# Altium project LimeSDR_1v2.PrjPcb (part 1 of 2)
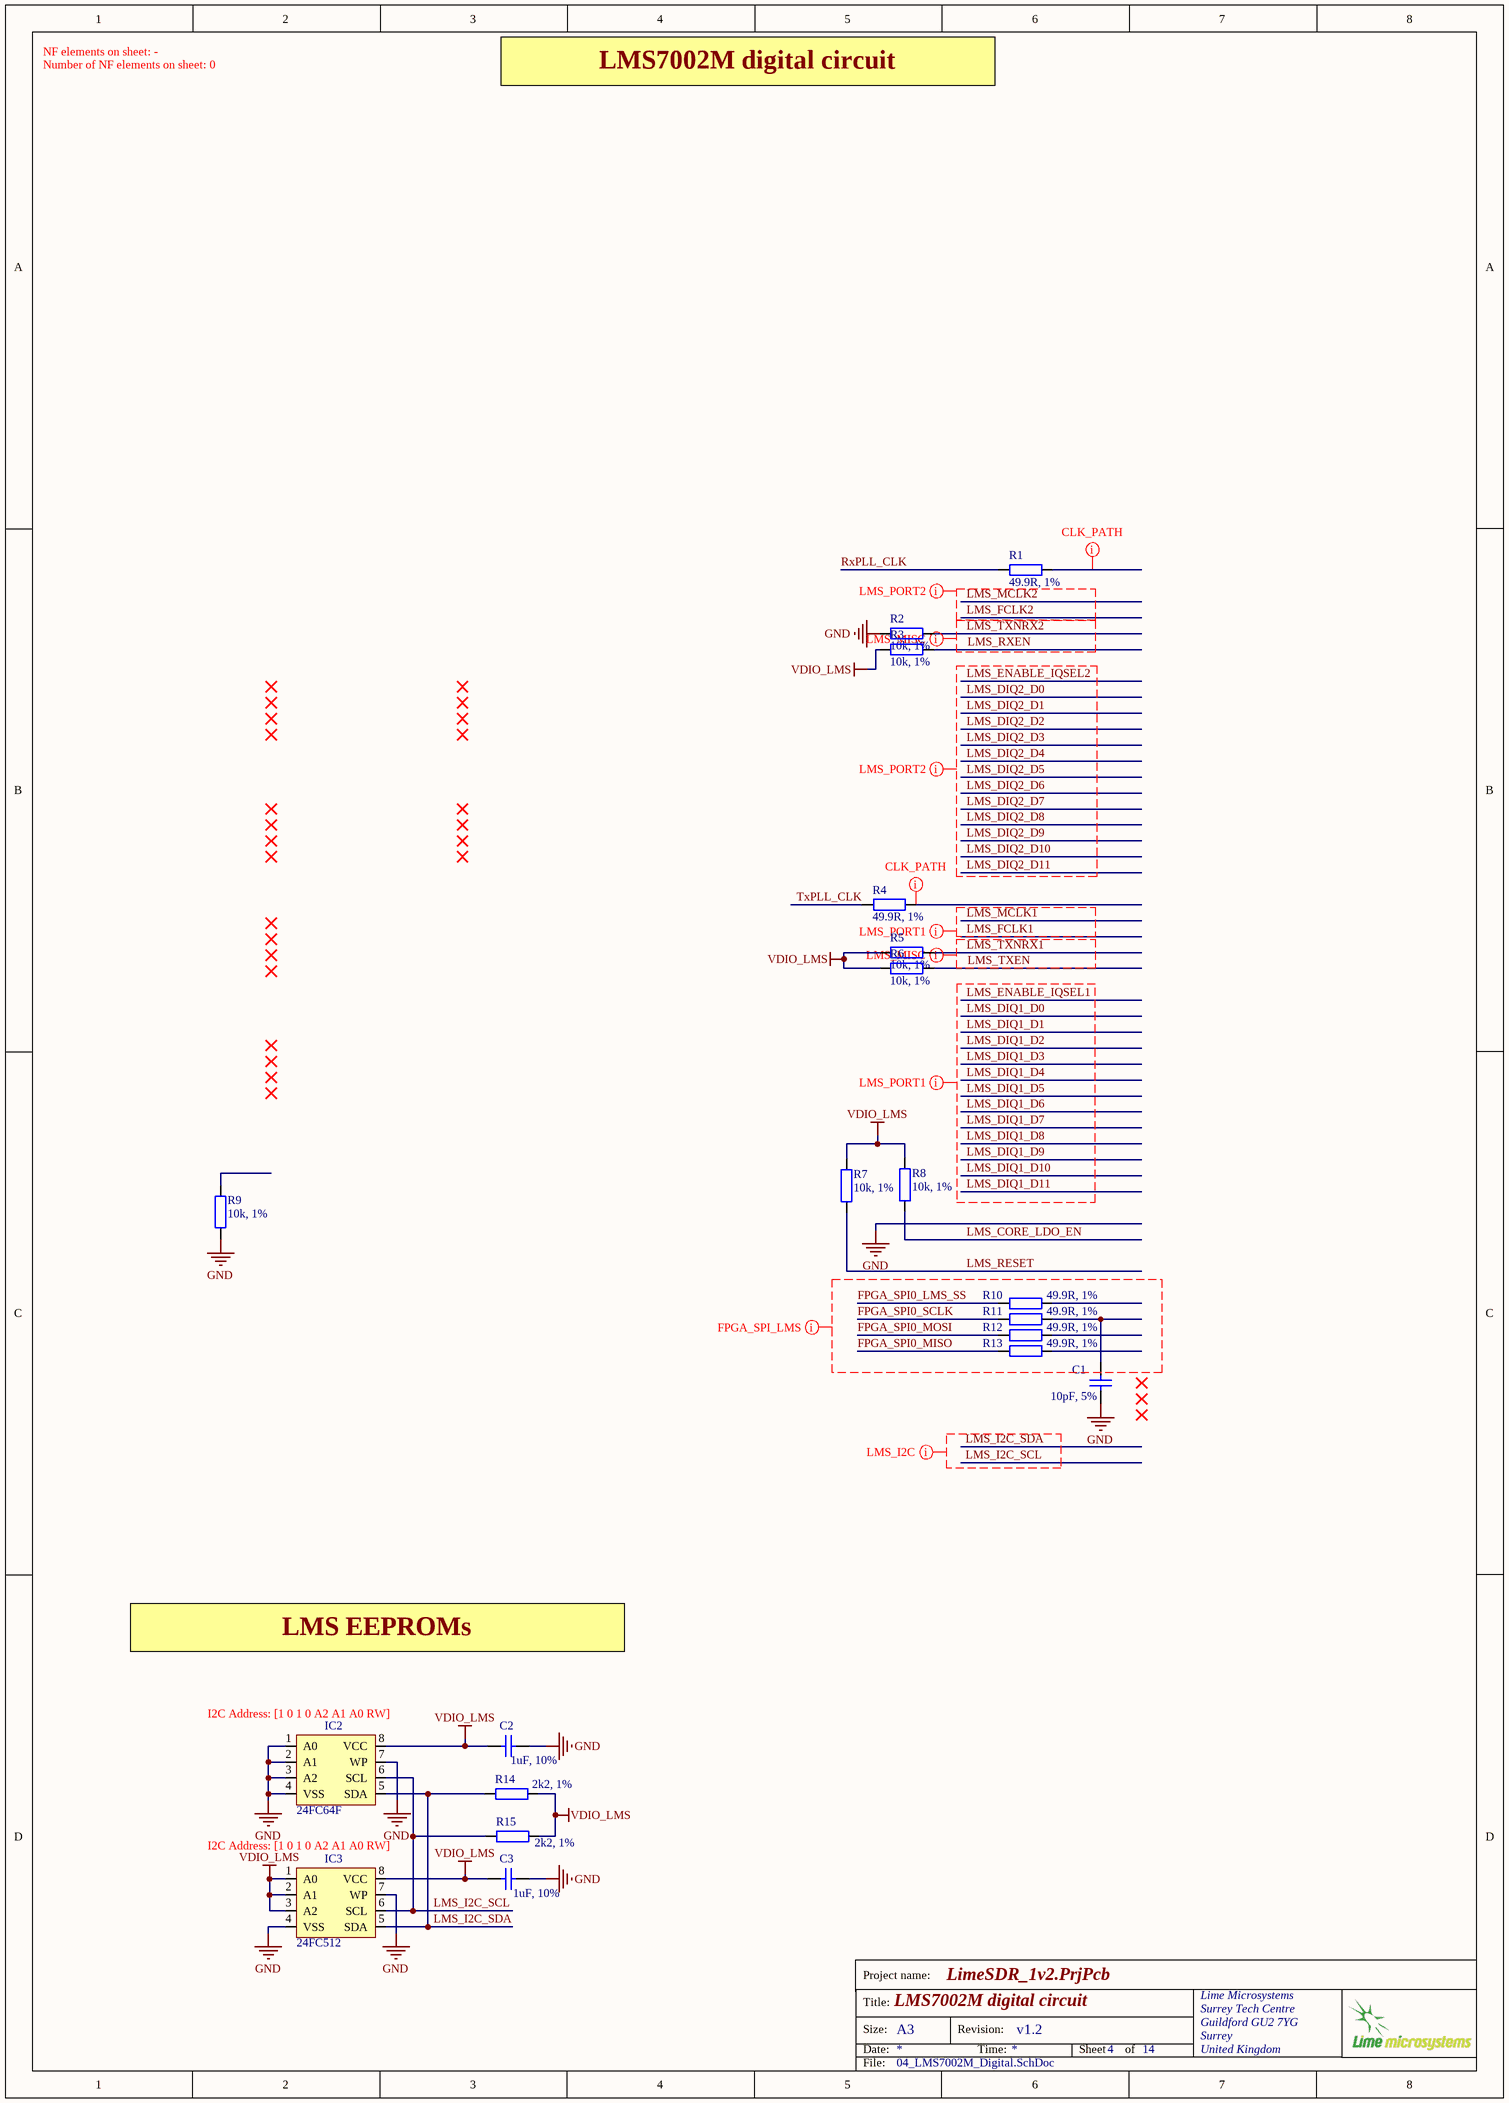
[diagram p0: 04_LMS7002M_Digital.SchDoc]
8 sheets, 375 parts. Net scope: global (net labels, ports and power ports of the same name join across sheets).
Board file: LimeSDR_1v2.PcbDoc
Sheets:
  04_LMS7002M_Digital.SchDoc
  05_LMS7002M_RF.SchDoc
  06_LMS7002M_Power.SchDoc
  07_FPGA_banks_1_2_3_4.SchDoc
  08_FPGA_banks_5_6_7_8.SchDoc
  10_DDR2.SchDoc
  12_USB3_0_power.SchDoc
  13_Clocks.SchDoc

## Sheet 04_LMS7002M_Digital.SchDoc: LMS7002M digital circuit
size A3 portrait; Organization: Lime Microsystems; Address1: Surrey Tech Centre; Address2: Guildford GU2 7YG; Address3: Surrey; Address4: United Kingdom; Revision: v1.2; SheetNumber: 4; SheetTotal: 14

### Parts
C1  10pF, 5%  [CAP0402]
C2  1uF, 10%  [CAP0402]
C3  1uF, 10%  [CAP0402]
IC2  24FC64F  [24FC512]
IC3  24FC512  [24FC512]
R1  49.9R, 1%  [RES0402]
R2  10k, 1%  [RES0402]
R3  10k, 1%  [RES0402]
R4  49.9R, 1%  [RES0402]
R5  10k, 1%  [RES0402]
R6  10k, 1%  [RES0402]
R7  10k, 1%  [RES0402]
R8  10k, 1%  [RES0402]
R9  10k, 1%  [RES0402]
R10  49.9R, 1%  [RES0402]
R11  49.9R, 1%  [RES0402]
R12  49.9R, 1%  [RES0402]
R13  49.9R, 1%  [RES0402]
R14  2k2, 1%  [RES0402]
R15  2k2, 1%  [RES0402]

### Nets
GND: C1.2 C2.1 C3.1 IC2.1(A0) IC2.2(A1) IC2.3(A2) IC2.4(VSS) IC2.7(WP) IC3.4(VSS) IC3.7(WP) R2.1 R9.2
VDIO_LMS: C2.2 C3.2 IC2.8(VCC) IC3.1(A0) IC3.2(A1) IC3.3(A2) IC3.8(VCC) R3.1 R5.1 R6.1 R7.2 R8.2 R14.1 R15.1
FPGA_SPI0_LMS_SS: R10.2
FPGA_SPI0_MISO: R13.2
FPGA_SPI0_MOSI: R12.2
FPGA_SPI0_SCLK: R11.2
LMS_CORE_LDO_EN: R8.1
LMS_I2C_SCL: IC2.6(SCL) IC3.6(SCL) R15.2
LMS_I2C_SDA: IC2.5(SDA) IC3.5(SDA) R14.2
LMS_RESET: R7.1
LMS_RXEN: R3.2
LMS_TXEN: R6.2
LMS_TXNRX1: R5.2
LMS_TXNRX2: R2.2
RxPLL_CLK: R1.2
TxPLL_CLK: R4.2
NetC1_1: C1.1 R11.1

Not connected (* = marked no-connect by the designer): R1 1; R4 1; R9 1; R10 1; R12 1; R13 1

### Layout directives
net class CLK_PATH: NetR1_1, NetR4_1
net class FPGA_SPI_LMS: FPGA_SPI0_LMS_SS, FPGA_SPI0_MISO, FPGA_SPI0_MOSI, FPGA_SPI0_SCLK
net class LMS_I2C: LMS_I2C_SCL, LMS_I2C_SDA
net class LMS_MISC: LMS_RXEN, LMS_TXNRX1, LMS_TXNRX2
net class LMS_PORT2: LMS_DIQ2_D0, LMS_DIQ2_D1, LMS_DIQ2_D2, LMS_DIQ2_D3, LMS_DIQ2_D4, LMS_DIQ2_D5, LMS_DIQ2_D6, LMS_DIQ2_D7, LMS_DIQ2_D8, LMS_DIQ2_D9, LMS_DIQ2_D10, LMS_DIQ2_D11, LMS_ENABLE_IQSEL2, LMS_FCLK2, LMS_MCLK2
net class LMS_PORT1: LMS_DIQ1_D0, LMS_DIQ1_D1, LMS_DIQ1_D2, LMS_DIQ1_D3, LMS_DIQ1_D4, LMS_DIQ1_D5, LMS_DIQ1_D6, LMS_DIQ1_D7, LMS_DIQ1_D8, LMS_DIQ1_D9, LMS_DIQ1_D10, LMS_DIQ1_D11, LMS_ENABLE_IQSEL1, LMS_MCLK1

### Notes on the sheet
- NF elements on sheet: -
- Number of NF elements on sheet: 0
- LMS7002M digital circuit
- LMS EEPROMs
- (near IC2) I2C Address: [1 0 1 0 A2 A1 A0 RW]
- (near IC3) I2C Address: [1 0 1 0 A2 A1 A0 RW]
- Project name:
- Title:
- Size:
- Date:
- A3
- Revision:
- Time:
- Sheet
- of
- File:

### Library data of the parts
C1 = Cap_0402: Manufacturer Part Number 1: 04023A100JAT2A; Manufacturer: AVX; Part Description: 10pF ±5% 25V C0G, NP0, Ceramic Capacitor, Surface Mount, MLCC 0402; Voltage Rating: 25; Ceramic Capacitor Case: 0402 [1005 Metric]; Capacitor Case Style: 0402 [1005 Metric]<!--FANDB--><div class="features-and-benefits-container"></div>; Dielectric Characteristic: C0G / NP0; SVHC: No SVHC (16-Jun-2014); Capacitance: 10; Value: 10pF, 5%; Supplier 1: Farnell; Supplier Part Number 1: 2332478RL; Capacitance Tolerance: ± 5%; Product Range: -; RoHS: YES; Operating Temperature Min: -55; Operating Temperature Max: 125; Capacitance Tolerance ±: ± 5%; MSL: MSL 1 - Unlimited; Packaging: Cut Tape
C2 C3 = Cap_0402: Manufacturer Part Number 1: GRM155R61A105KE15J; Manufacturer: TDK; Part Description: 1µF ±10% 10V X5R Ceramic Capacitor -55°C ~ 85°C Surface Mount, MLCC 0402 (1005 Metric) 0.039" L x 0.020" W (1.00mm x 0.50mm); Voltage Rating: 10; Product Range: TDK - C Series; Ceramic Capacitor Case: 0402 [1005 Metric]; Capacitance: 1; Dielectric Characteristic: X6; Value: 1uF, 10%; Supplier 1: Newark; Supplier Part Number 1: 490-6298-2-ND; Capacitance Tolerance: ± 10%; MSL: -; RoHS: YES
IC2 = 24FC64F: Manufacturer Part Number 1: 24FC64F-I/ST; Manufacturer: Microchip Technology; Part Description: IC EEPROM 64KBIT 1MHZ 8TSSOP; Format - Memory: EEPROMs - Serial; Speed: 400kHz, 1MHz; Interface: I²C, 2-Wire Serial; Memory Type: EEPROM; Memory Size: 64K (8K x 8); Voltage - Supply: 1.7 V ~ 5.5 V; Supplier 1: Digi-Key; Packaging: Tube; Supplier Device Package: 8-TSSOP; Operating Temperature: -40°C ~ 85°C; RoHS: RoHS Compliant; Category: Integrated Circuits (ICs); Package / Case: 8-TSSOP (0.173", 4.40mm Width); Supplier Part Number 1: 24FC64F-I/ST-ND
IC3 = 24FC512: Manufacturer Part Number 1: 24FC512-I/ST; Manufacturer: Microchip Technology; Part Description: IC EEPROM 512KBIT 1MHZ 8TSSOP; Speed: 400kHz, 1MHz; Memory Type: EEPROM; Memory Size: 512K (64K x 8); Voltage - Supply: 1.7 V ~ 5.5 V; Interface: I²C, 2-Wire Serial; Format - Memory: EEPROMs - Serial; Supplier 1: Digi-Key; RoHS: RoHS Compliant; Packaging: Tube; Operating Temperature: -40°C ~ 85°C; Supplier Device Package: 8-TSSOP; Category: Integrated Circuits (ICs); Package / Case: 8-TSSOP (0.173", 4.40mm Width); Supplier Part Number 1: 24FC512-I/ST-ND
R1 R4 R10-R13 = Res_0402: Manufacturer: Samsung Electro-Mechanics America, Inc.; Manufacturer Part Number: RC1005F49R9CS; Part Description: RES SMD 49.9 OHM 1% 1/16W 0402; Temperature Coefficient: ±100ppm/°C; Resistance (Ohms): 49.9; Power (Watts): 0.063W, 1/16W; Number of Terminations: 2; Size / Dimension: 0.039" L x 0.020" W (1.00mm x 0.50mm); Supplier Device Package: 0402 (1005 Metric); RoHS: RoHS Compliant; Supplier Part Number 1: 1276-3469-6-ND; Features: -; Packaging: Digi-Reel®; Tolerance: ±1%; Height: 0.016" (0.40mm); Category: Resistors; Composition: Thick Film; Package / Case: 0402 (1005 Metric); Supplier 1: Digi-Key; Operating Temperature: -55°C ~ 155°C; Value: 49.9R, 1%
R2 R3 R5-R9 = Res_0402: Manufacturer: Yageo; Manufacturer Part Number 1: RC0402FR-0710KL; Part Description: RES SMD 10K OHM 1% 1/16W 0402; Temperature Coefficient: ±100ppm/°C; Power (Watts): 0.063W, 1/16W; Value: 10k, 1%; Supplier 1: Digi-Key; Supplier Part Number 1: 311-10.0KLRTR-ND; Resistance (Ohms): 10k; Packaging: Tape & Reel (TR); RoHS: RoHS Compliant; Package / Case: 0402 (1005 Metric); Tolerance: ±1%; Operating Temperature: -55°C ~ 155°C; Size / Dimension: 0.039" L x 0.020" W (1.00mm x 0.50mm); Number of Terminations: 2; Category: Resistors; Height: 0.016" (0.40mm); Supplier Device Package: 0402; Features: Moisture Resistant; Composition: Thick Film
R14 R15 = Res_0402: Manufacturer: Stackpole Electronics Inc; Manufacturer Part Number 1: RMCF0402FT2K20; Part Description: RES SMD 2.2K OHM 1% 1/16W 0402; Resistance (Ohms): 2.2k; Temperature Coefficient: ±100ppm/°C; Power (Watts): 0.063W, 1/16W; Value: 2k2, 1%; Supplier 1: Digi-Key; Supplier Part Number 1: RMCF0402FT2K20CT-ND; Supplier Device Package: 0402; Package / Case: 0402 (1005 Metric); Size / Dimension: 0.039" L x 0.020" W (1.00mm x 0.50mm); Operating Temperature: -55°C ~ 155°C; Composition: Thick Film; Category: Resistors; Features: -; Height: 0.016" (0.40mm); RoHS: RoHS Compliant; Number of Terminations: 2; Packaging: Cut Tape (CT); Tolerance: ±1%

## Sheet 05_LMS7002M_RF.SchDoc: LMS7002M RF
size A3; Organization: Lime Microsystems; Address1: Surrey Tech Centre; Address2: Guildford GU2 7YG; Address3: Surrey; Address4: United Kingdom; Revision: v1.2; SheetNumber: 5; SheetTotal: 14
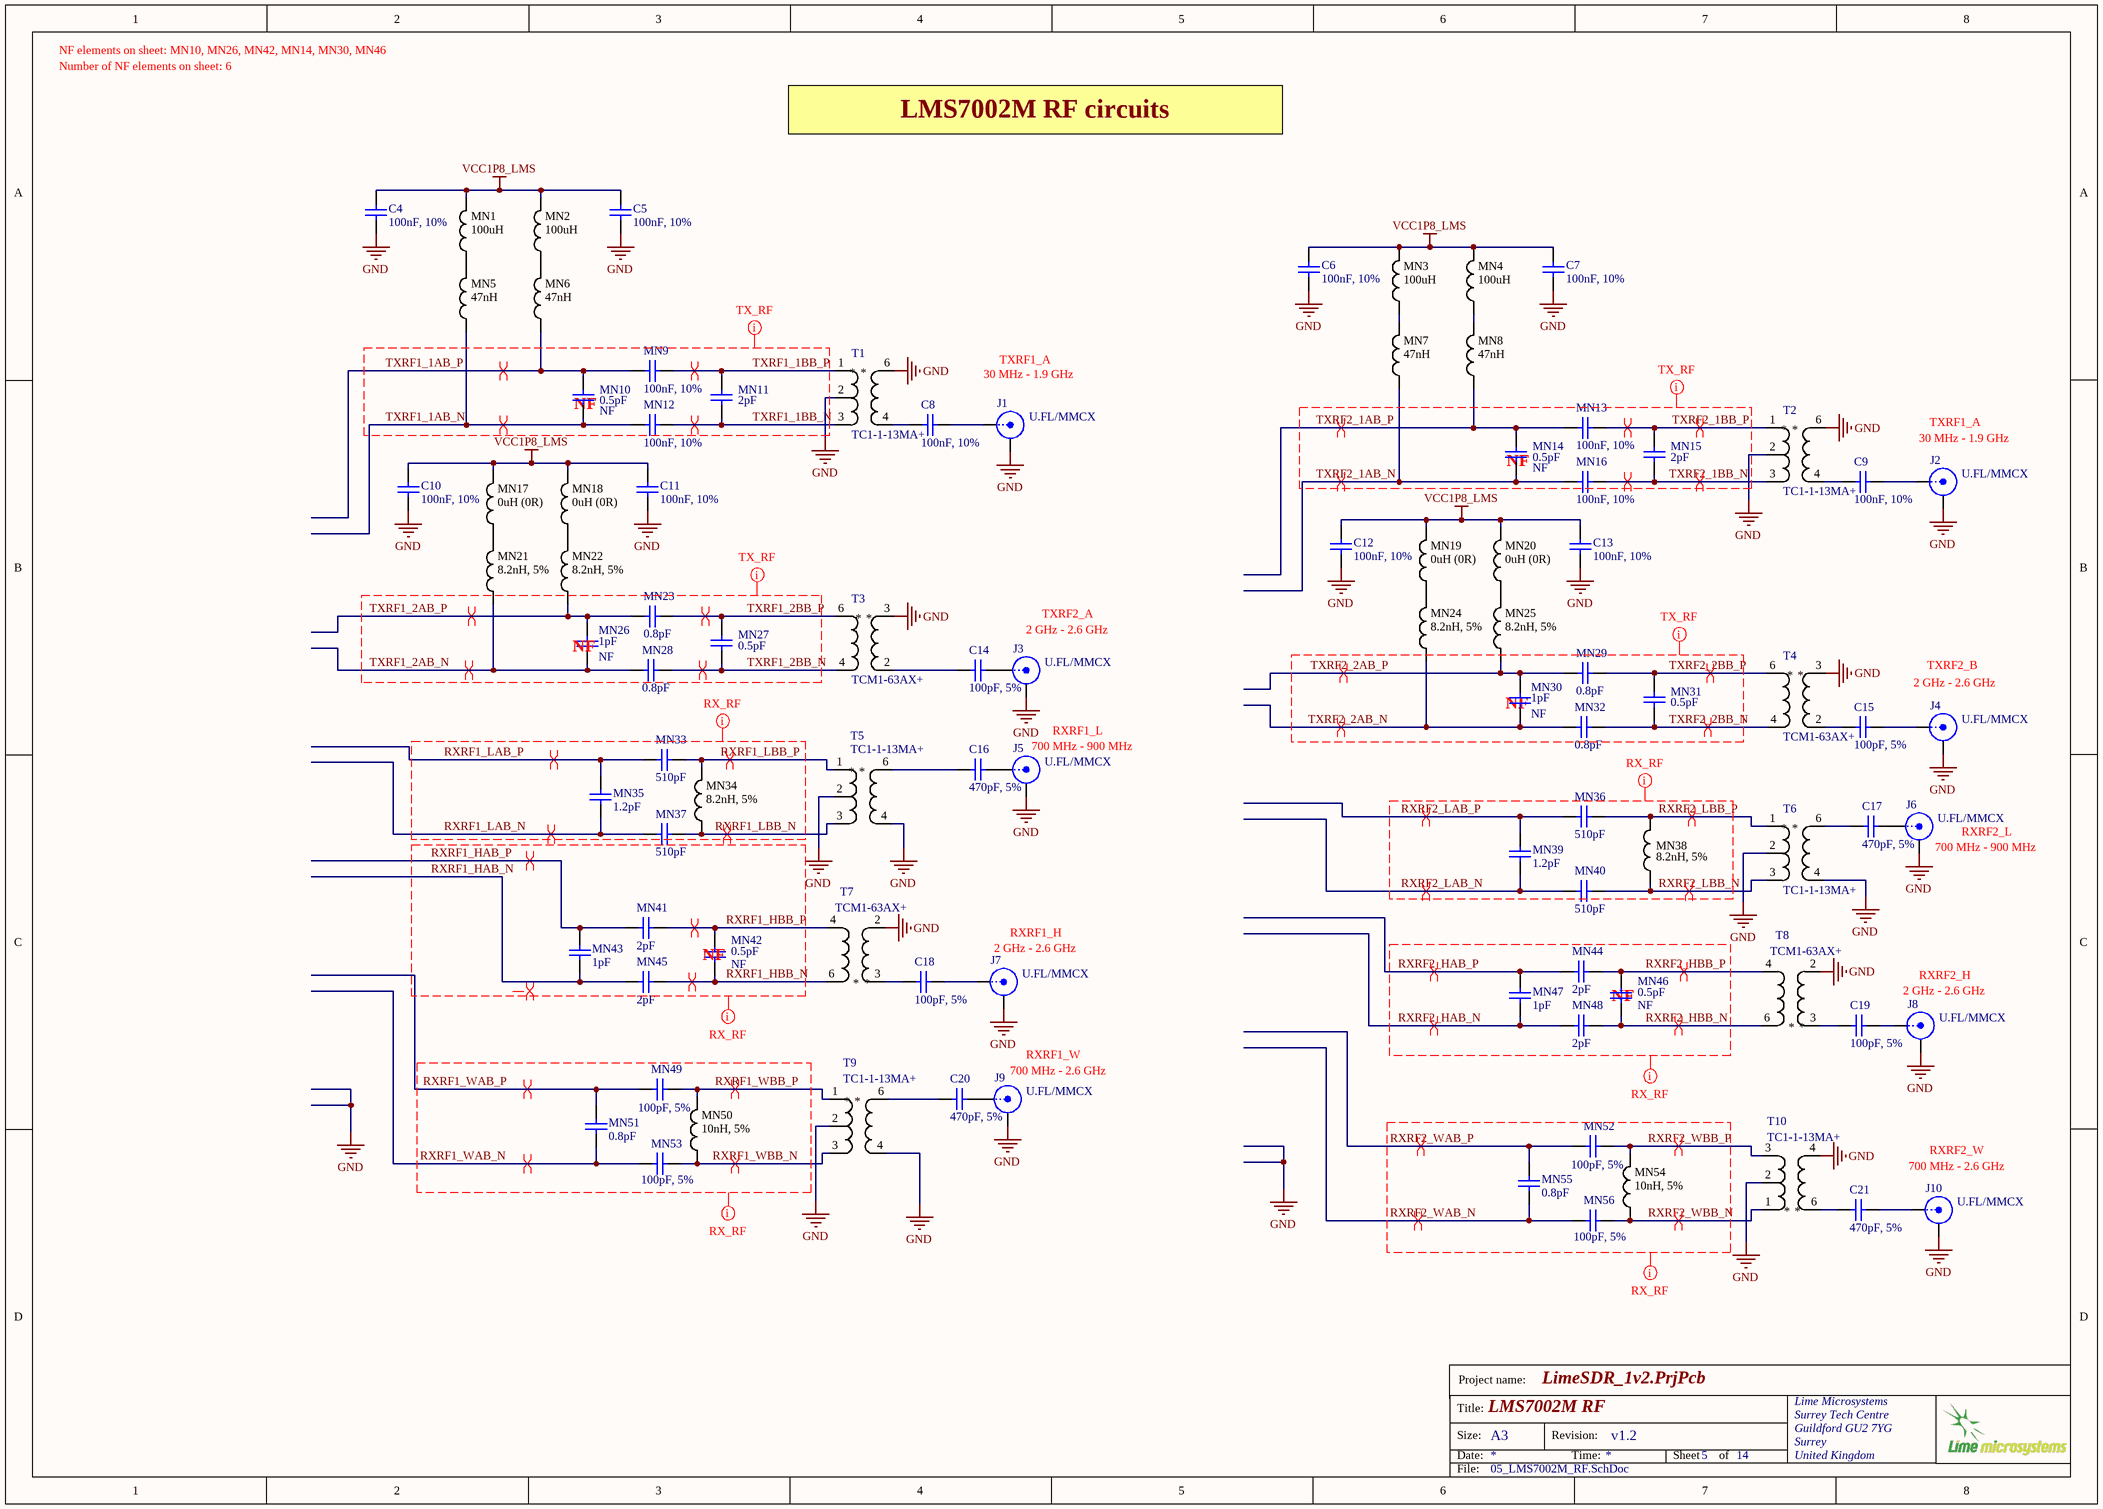
[diagram p1: 05_LMS7002M_RF.SchDoc]

### Parts
C4  100nF, 10%  [CAP0402]
C5  100nF, 10%  [CAP0402]
C6  100nF, 10%  [CAP0402]
C7  100nF, 10%  [CAP0402]
C8  100nF, 10%  [CAP0402]
C9  100nF, 10%  [CAP0402]
C10  100nF, 10%  [CAP0402]
C11  100nF, 10%  [CAP0402]
C12  100nF, 10%  [CAP0402]
C13  100nF, 10%  [CAP0402]
C14  100pF, 5%  [CAP0402]
C15  100pF, 5%  [CAP0402]
C16  470pF, 5%  [CAP0402]
C17  470pF, 5%  [CAP0402]
C18  100pF, 5%  [CAP0402]
C19  100pF, 5%  [CAP0402]
C20  470pF, 5%  [CAP0402]
C21  470pF, 5%  [CAP0402]
J1  U.FL/MMCX  [MMCX_UFL_conn_u]
J2  U.FL/MMCX  [MMCX_UFL_conn_u]
J3  U.FL/MMCX  [MMCX_UFL_conn_u]
J4  U.FL/MMCX  [MMCX_UFL_conn_u]
J5  U.FL/MMCX  [MMCX_UFL_conn_u]
J6  U.FL/MMCX  [MMCX_UFL_conn_u]
J7  U.FL/MMCX  [MMCX_UFL_conn_u]
J8  U.FL/MMCX  [MMCX_UFL_conn_u]
J9  U.FL/MMCX  [MMCX_UFL_conn_u]
J10  U.FL/MMCX  [MMCX_UFL_conn_u]
MN1  100uH  [RES0805]
MN2  100uH  [RES0805]
MN3  100uH  [RES0805]
MN4  100uH  [RES0805]
MN5  47nH  [RES0402]
MN6  47nH  [RES0402]
MN7  47nH  [RES0402]
MN8  47nH  [RES0402]
MN9  100nF, 10%  [CAP0402]
MN10  0.5pF  Assembly Info: NF  [CAP0402]
MN11  2pF  [CAP0402]
MN12  100nF, 10%  [CAP0402]
MN13  100nF, 10%  [CAP0402]
MN14  0.5pF  Assembly Info: NF  [CAP0402]
MN15  2pF  [CAP0402]
MN16  100nF, 10%  [CAP0402]
MN17  0uH (0R)  [RES0805]
MN18  0uH (0R)  [RES0805]
MN19  0uH (0R)  [RES0805]
MN20  0uH (0R)  [RES0805]
MN21  8.2nH, 5%  [RES0402]
MN22  8.2nH, 5%  [RES0402]
MN23  0.8pF  [CAP0402]
MN24  8.2nH, 5%  [RES0402]
MN25  8.2nH, 5%  [RES0402]
MN26  1pF  Assembly Info: NF  [CAP0402]
MN27  0.5pF  [CAP0402]
MN28  0.8pF  [CAP0402]
MN29  0.8pF  [CAP0402]
MN30  1pF  Assembly Info: NF  [CAP0402]
MN31  0.5pF  [CAP0402]
MN32  0.8pF  [CAP0402]
MN33  510pF  [CAP0402]
MN34  8.2nH, 5%  [RES0402]
MN35  1.2pF  [CAP0402]
MN36  510pF  [CAP0402]
MN37  510pF  [CAP0402]
MN38  8.2nH, 5%  [RES0402]
MN39  1.2pF  [CAP0402]
MN40  510pF  [CAP0402]
MN41  2pF  [CAP0402]
MN42  0.5pF  Assembly Info: NF  [CAP0402]
MN43  1pF  [CAP0402]
MN44  2pF  [CAP0402]
MN45  2pF  [CAP0402]
MN46  0.5pF  Assembly Info: NF  [CAP0402]
MN47  1pF  [CAP0402]
MN48  2pF  [CAP0402]
MN49  100pF, 5%  [CAP0402]
MN50  10nH, 5%  [RES0402]
MN51  0.8pF  [CAP0402]
MN52  100pF, 5%  [CAP0402]
MN53  100pF, 5%  [CAP0402]
MN54  10nH, 5%  [RES0402]
MN55  0.8pF  [CAP0402]
MN56  100pF, 5%  [CAP0402]
T1  TC1-1-13MA+  [TC1-1-13MA+_v2]
T2  TC1-1-13MA+  [TC1-1-13MA+_v2]
T3  TCM1-63AX+  [TCM1-63AX+_v2]
T4  TCM1-63AX+  [TCM1-63AX+_v2]
T5  TC1-1-13MA+  [TC1-1-13MA+_v2]
T6  TC1-1-13MA+  [TC1-1-13MA+_v2]
T7  TCM1-63AX+  [TCM1-63AX+_v2]
T8  TCM1-63AX+  [TCM1-63AX+_v2]
T9  TC1-1-13MA+  [TC1-1-13MA+_v2]
T10  TC1-1-13MA+  [TC1-1-13MA+_v2]

### Nets
GND: C4.1 C5.1 C6.1 C7.1 C10.1 C11.1 C12.1 C13.1 J1.2(Y) J2.2(Y) J3.2(Y) J4.2(Y) J5.2(Y) J6.2(Y) J7.2(Y) J8.2(Y) J9.2(Y) J10.2(Y) T1.2 T1.6 T2.2 T2.6 T3.3 T4.3 T5.2 T5.4 T6.2 T6.4 T7.2 T8.2 T9.2 T9.4 T10.2 T10.4
VCC1P8_LMS: C4.2 C5.2 C6.2 C7.2 C10.2 C11.2 C12.2 C13.2 MN1.2 MN2.2 MN3.2 MN4.2 MN17.2 MN18.2 MN19.2 MN20.2
RXRF1_HAB_N: MN43.1 MN45.2
RXRF1_HAB_P: MN41.2 MN43.2
RXRF1_HBB_N: MN42.1 MN45.1 T7.6
RXRF1_HBB_P: MN41.1 MN42.2 T7.4
RXRF1_LAB_N: MN35.1 MN37.2
RXRF1_LAB_P: MN33.2 MN35.2
RXRF1_LBB_N: MN34.1 MN37.1 T5.3
RXRF1_LBB_P: MN33.1 MN34.2 T5.1
RXRF1_WAB_N: MN51.2 MN53.2
RXRF1_WAB_P: MN49.2 MN51.1
RXRF1_WBB_N: MN50.1 MN53.1 T9.3
RXRF1_WBB_P: MN49.1 MN50.2 T9.1
RXRF2_HAB_N: MN47.1 MN48.2
RXRF2_HAB_P: MN44.2 MN47.2
RXRF2_HBB_N: MN46.1 MN48.1 T8.6
RXRF2_HBB_P: MN44.1 MN46.2 T8.4
RXRF2_LAB_N: MN39.1 MN40.2
RXRF2_LAB_P: MN36.2 MN39.2
RXRF2_LBB_N: MN38.1 MN40.1 T6.3
RXRF2_LBB_P: MN36.1 MN38.2 T6.1
RXRF2_WAB_N: MN55.2 MN56.2
RXRF2_WAB_P: MN52.2 MN55.1
RXRF2_WBB_N: MN54.1 MN56.1 T10.1
RXRF2_WBB_P: MN52.1 MN54.2 T10.3
TXRF1_1AB_N: MN5.1 MN10.1 MN12.1
TXRF1_1AB_P: MN6.1 MN9.2 MN10.2
TXRF1_1BB_N: MN11.1 MN12.2 T1.3
TXRF1_1BB_P: MN9.1 MN11.2 T1.1
TXRF1_2AB_N: MN21.1 MN26.2 MN28.2
TXRF1_2AB_P: MN22.1 MN23.2 MN26.1
TXRF1_2BB_N: MN27.1 MN28.1 T3.4
TXRF1_2BB_P: MN23.1 MN27.2 T3.6
TXRF2_1AB_N: MN7.1 MN14.1 MN16.1
TXRF2_1AB_P: MN8.1 MN13.2 MN14.2
TXRF2_1BB_N: MN15.1 MN16.2 T2.3
TXRF2_1BB_P: MN13.1 MN15.2 T2.1
TXRF2_2AB_N: MN24.1 MN30.2 MN32.2
TXRF2_2AB_P: MN25.1 MN29.2 MN30.1
TXRF2_2BB_N: MN31.1 MN32.1 T4.4
TXRF2_2BB_P: MN29.1 MN31.2 T4.6
NetC8_1: C8.1 J1.1(X)
NetC8_2: C8.2 T1.4
NetC9_1: C9.1 J2.1(X)
NetC9_2: C9.2 T2.4
NetC14_1: C14.1 J3.1(X)
NetC14_2: C14.2 T3.2
NetC15_1: C15.1 J4.1(X)
NetC15_2: C15.2 T4.2
NetC16_1: C16.1 J5.1(X)
NetC16_2: C16.2 T5.6
NetC17_1: C17.1 J6.1(X)
NetC17_2: C17.2 T6.6
NetC18_1: C18.1 J7.1(X)
NetC18_2: C18.2 T7.3
NetC19_1: C19.1 J8.1(X)
NetC19_2: C19.2 T8.3
NetC20_1: C20.1 J9.1(X)
NetC20_2: C20.2 T9.6
NetC21_1: C21.1 J10.1(X)
NetC21_2: C21.2 T10.6
NetMN1_1: MN1.1 MN5.2
NetMN2_1: MN2.1 MN6.2
NetMN3_1: MN3.1 MN7.2
NetMN4_1: MN4.1 MN8.2
NetMN17_1: MN17.1 MN21.2
NetMN18_1: MN18.1 MN22.2
NetMN19_1: MN19.1 MN24.2
NetMN20_1: MN20.1 MN25.2

### Layout directives
differential pair: RXRF1_HAB_N, RXRF1_HAB_P, RXRF1_HBB_N, RXRF1_HBB_P, RXRF1_LAB_N, RXRF1_LAB_P, RXRF1_LBB_N, RXRF1_LBB_P, RXRF1_WAB_N, RXRF1_WAB_P, RXRF1_WBB_N, RXRF1_WBB_P, RXRF2_HAB_N, RXRF2_HAB_P, RXRF2_HBB_N, RXRF2_HBB_P, RXRF2_LAB_N, RXRF2_LAB_P, RXRF2_LBB_N, RXRF2_LBB_P, RXRF2_WAB_N, RXRF2_WAB_P, RXRF2_WBB_N, RXRF2_WBB_P, TXRF1_1AB_N, TXRF1_1AB_P, TXRF1_1BB_N, TXRF1_1BB_P, TXRF1_2AB_N, TXRF1_2AB_P, TXRF1_2BB_N, TXRF1_2BB_P, TXRF2_1AB_N, TXRF2_1AB_P, TXRF2_1BB_N, TXRF2_1BB_P, TXRF2_2AB_N, TXRF2_2AB_P, TXRF2_2BB_N, TXRF2_2BB_P
net class TX_RF: TXRF1_1AB_N, TXRF1_1AB_P, TXRF1_1BB_N, TXRF1_1BB_P, TXRF1_2AB_N, TXRF1_2AB_P, TXRF1_2BB_N, TXRF1_2BB_P, TXRF2_1AB_N, TXRF2_1AB_P, TXRF2_1BB_N, TXRF2_1BB_P, TXRF2_2AB_N, TXRF2_2AB_P, TXRF2_2BB_N, TXRF2_2BB_P
net class RX_RF: RXRF1_HAB_N, RXRF1_HAB_P, RXRF1_HBB_N, RXRF1_HBB_P, RXRF1_LAB_N, RXRF1_LAB_P, RXRF1_LBB_N, RXRF1_LBB_P, RXRF1_WAB_N, RXRF1_WAB_P, RXRF1_WBB_N, RXRF1_WBB_P, RXRF2_HAB_N, RXRF2_HAB_P, RXRF2_HBB_N, RXRF2_HBB_P, RXRF2_LAB_N, RXRF2_LAB_P, RXRF2_LBB_N, RXRF2_LBB_P, RXRF2_WAB_N, RXRF2_WAB_P, RXRF2_WBB_N, RXRF2_WBB_P

### Notes on the sheet
- Number of NF elements on sheet: 6
- NF elements on sheet: MN10, MN26, MN42, MN14, MN30, MN46
- LMS7002M RF circuits
- 30 MHz - 1.9 GHz
- TXRF1_A
- (near MN10) NF
- (near J2) 30 MHz - 1.9 GHz
- (near MN14) NF
- (near MN26) NF
- 2 GHz - 2.6 GHz
- TXRF2_A
- (near MN30) NF
- TXRF2_B
- (near J5) 700 MHz - 900 MHz
- RXRF1_L
- (near J6) 700 MHz - 900 MHz
- (near J6) RXRF2_L
- (near MN42) NF
- (near J7) 2 GHz - 2.6 GHz
- (near J7) RXRF1_H
- RXRF2_H
- RXRF1_W
- (near MN46) NF
- (near J8) 2 GHz - 2.6 GHz
- (near J9) 700 MHz - 2.6 GHz
- 700 MHz - 2.6 GHz
- (near J10) RXRF2_W
- Project name:
- Title:
- Size:
- Date:
- A3
- Revision:
- Time:
- Sheet
- of
- File:

### Library data of the parts
C4-C13 = Cap_0402: Manufacturer: Murata Electronics; Manufacturer Part Number: GRM155R71C104KA88D; Part Description: 0.10µF ±10% 16V X7R Ceramic Capacitor -55°C ~ 125°C Surface Mount, MLCC 0402 (1005 Metric) 0.039" L x 0.020" W (1.00mm x 0.50mm); Voltage Rating DC: 16 V; Type: General Purpose MLCC; Capacitance: 0.1 uF; Case Length: 1 mm; Dielectric: X7R; Case Height: 0.5 mm; Temperature Coefficient / Code: +/- 15 %; Value: 100nF, 10%; Supplier 1: Mouser; Supplier Part Number 1: 81-GRM155R71C104KA88; Case Code - in: 0402; RoHS: RoHS Compliant; Operating Temperature Range: - 55 C to + 125 C; Series: GRM; Termination Style: SMD/SMT; Tolerance: 10 %; Package / Case: 0402 (1005 metric); Maximum Operating Temperature: + 125 C; Case Code - mm: 1005; Minimum Operating Temperature: - 55 C; Product Category: Low & Medium Capacitance SMD Ceramic Chip Capacitors; Packaging: Reel; Product: General Type MLCCs; Category: Multilayer Ceramic Capacitors MLCC - SMD/SMT; Brand: Murata Electronics; Case Width: 0.5 mm; RoHS - Mouser: Y; Standard Pack Qty: 10000; Minimum Order Quantity: 1; Reeling: True; Manufacturer Part Number 1: GRM155R71C104KA88D
C14 C15 C18 C19 MN49 MN52 MN53 MN56 = Cap_0402: Manufacturer Part Number 1: CC0402JRNPO9BN101; Manufacturer: Yageo; Part Description: 100pF ±5% 50V C0G, NP0 Ceramic Capacitor -55°C ~ 125°C Surface Mount, MLCC 0402 (1005 Metric) 0.039" L x 0.020" W (1.00mm x 0.50mm); Temperature Coefficient: C0G, NP0; Voltage - Rated: 50V; Value: 100pF, 5%; Capacitance: 100pF; Thickness (Max): 0.022" (0.55mm); Size / Dimension: 0.039" L x 0.020" W (1.00mm x 0.50mm); Tolerance: ±5%; RoHS: RoHS Compliant; Ratings: -; Package / Case: 0402 (1005 Metric); Mounting Type: Surface Mount, MLCC; Height - Seated (Max): -; Features: -; Lead Spacing: -; Operating Temperature: -55°C ~ 125°C; Packaging: Cut Tape (CT); Applications: General Purpose; Lead Style: -; Supplier 1: Digi-Key; Category: Capacitors; Supplier Part Number 1: 311-1024-1-ND
C16 C17 C20 C21 = Cap_0402: Manufacturer Part Number: C1005C0G1H471J050BA; Manufacturer: TDK Corporation; Part Description: 470pF ±5% 50V C0G, NP0 Ceramic Capacitor -55°C ~ 125°C Surface Mount, MLCC 0402 (1005 Metric) 0.039" L x 0.020" W (1.00mm x 0.50mm); Temperature Coefficient: C0G, NP0; Voltage - Rated: 50V; Value: 470pF, 5%; Supplier 1: Digi-Key; Supplier Part Number 1: 445-2656-6-ND; Ratings: -; Package / Case: 0402 (1005 Metric); Capacitance: 470pF; Packaging: Digi-Reel®; RoHS: RoHS Compliant; Tolerance: ±5%; Lead Style: -; Thickness (Max): 0.022" (0.55mm); Size / Dimension: 0.039" L x 0.020" W (1.00mm x 0.50mm); Lead Spacing: -; Operating Temperature: -55°C ~ 125°C; Height - Seated (Max): -; Applications: General Purpose; Mounting Type: Surface Mount, MLCC; Category: Capacitors; Features: -
J1-J10 = RF_IF_connector: CONN UMC RCPT STR 50 OHM SMD; Manufacturer: Molex, LLC; Manufacturer Part Number 1: 0734120110; Body Finish: Nickel; Body Material: Phosphor Bronze; Center Contact Material: Brass; Center Contact Plating: Gold; Connector Style: Ultra Miniature Coaxial; Connector Type: Jack, Male Pin; Contact Termination: Solder; Dielectric Material: Liquid Crystal Polymer (LCP); Frequency - Max: 6GHz; Impedance: 50 Ohm; Voltage Rating: 60V; Cable Group: -; Category: Connectors, Interconnects; Fastening Type: Snap-On; Features: -; Housing Color: Silver; Ingress Protection: -; Mounting Type: Surface Mount; Operating Temperature: -40°C ~ 90°C; Packaging: Cut Tape (CT); RoHS: RoHS Compliant; Shield Termination: Solder; Supplier 1: Digi-Key; Supplier Part Number 1: WM5587CT-ND; Part Description: CONN UMC RCPT STR 50 OHM SMD
MN1-MN4 = Inductor_0603: Manufacturer: TDK Corporation; Manufacturer Part Number: MLF2012C101KT000; Part Description: FIXED IND 100UH 2MA 3.1 OHM SMD; Q @ Freq: 25 @ 1MHz; Shielding: Shielded; Current Rating: 2mA; Frequency - Self Resonant: 7MHz; Frequency - Test: 1MHz; Material - Core: Ferrite; Tolerance: ±10%; Inductance: 100µH; DC Resistance (DCR): 3.1 Ohm Max; Value: 100uH; Supplier 1: Digi-Key; Supplier Part Number 1: 445-1071-1-ND; Supplier Device Package: 0805 (2012 Metric); Size / Dimension: 0.079" L x 0.049" W (2.00mm x 1.25mm); Operating Temperature: -40°C ~ 85°C; Packaging: Cut Tape (CT); RoHS: RoHS Compliant; Current - Saturation: -; Height - Seated (Max): 0.057" (1.45mm); Package / Case: 0805 (2012 Metric); Mounting Type: Surface Mount; Type: Multilayer; Category: Inductors, Coils, Chokes
MN5-MN8 = Inductor_0603: Manufacturer: COILCRAFT; Manufacturer Part Number: 0402HP-47NXJLU; Part Description: INDUCTOR, RF, 47NH, 5%, 2.4GHZ, SMD; Product Range:0402HP Series; Inductance:47nH; Inductance Tolerance:± 5%; High Frequency Inductor Case:0402 [1005 Metric]; Self Resonant Frequency Min:2.4GHz; DC Resistance Max:0.58ohm; DC Current Rating:420mA; SVHC: No SVHC (15-Jun-2015); Inductance Tolerance: ± 5%; High Frequency Inductor Case: 0402 [1005 Metric]; Inductor Case Style: 0402 [1005 Metric]<!--FANDB--><div class="features-and-benefits-container"></div>; Inductance: 47; DC Resistance Max: 0.58; Self Resonant Frequency Min: 2.4; Product Range: 0402; DC Current Rating: 420; Inductor Construction: Wirewound; Supplier 1: Farnell; Supplier Part Number 1: 2285856; Packaging: Cut Tape; RoHS: Y-EX; value: 47nH
MN9 MN12 MN13 MN16 = Cap_0402: Manufacturer: Murata Electronics; Manufacturer Part Number: GRM155R71C104KA88D; Part Description: 0.10µF ±10% 16V X7R Ceramic Capacitor -55°C ~ 125°C Surface Mount, MLCC 0402 (1005 Metric) 0.039" L x 0.020" W (1.00mm x 0.50mm); Voltage Rating DC: 16 V; Capacitance: 0.1 uF; Case Length: 1 mm; Dielectric: X7R; Case Height: 0.5 mm; Temperature Coefficient / Code: +/- 15 %; Value: 100nF, 10%; Supplier 1: Mouser; Supplier Part Number 1: 81-GRM155R71C104KA88; Case Code - in: 0402; RoHS: RoHS Compliant; Operating Temperature Range: - 55 C to + 125 C; Series: GRM; Termination Style: SMD/SMT; Tolerance: 10 %; Package / Case: 0402 (1005 metric); Type: General Purpose MLCC; Maximum Operating Temperature: + 125 C; Case Code - mm: 1005; Minimum Operating Temperature: - 55 C; Product Category: Low & Medium Capacitance SMD Ceramic Chip Capacitors; Packaging: Reel; Product: General Type MLCCs; Category: Multilayer Ceramic Capacitors MLCC - SMD/SMT; Brand: Murata Electronics; Case Width: 0.5 mm; RoHS - Mouser: Y; Standard Pack Qty: 10000; Minimum Order Quantity: 1; Reeling: True; Manufacturer Part Number 1: GRM155R71C104KA88D
MN10 MN14 MN27 MN31 MN42 MN46 = Cap_0402: Manufacturer: Yageo; Manufacturer Part Number 1: CC0402CRNPO9BNR50; Part Description: 0.50pF ±0.25pF 50V C0G, NP0 Ceramic Capacitor -55°C ~ 125°C Surface Mount, MLCC 0402 (1005 Metric) 0.039" L x 0.020" W (1.00mm x 0.50mm); Capacitance: 0.50pF; Voltage - Rated: 50V; Temperature Coefficient: C0G, NP0; Tolerance: ±0.25pF; Value: 0.5pF; Supplier 1: Digi-Key; Supplier Part Number 1: 311-1001-1-ND; RoHS: RoHS Compliant; Thickness (Max): 0.022" (0.55mm); Features: -; Height - Seated (Max): -; Lead Spacing: -; Applications: General Purpose; Packaging: Cut Tape (CT); Ratings: -; Size / Dimension: 0.039" L x 0.020" W (1.00mm x 0.50mm); Lead Style: -; Mounting Type: Surface Mount, MLCC; Operating Temperature: -55°C ~ 125°C; Package / Case: 0402 (1005 Metric); Category: Capacitors
MN11 MN15 MN41 MN44 MN45 MN48 = Cap_0402: Manufacturer Part Number: 04025U2R0BAT2A; Manufacturer: AVX; Part Description: 2pF ±0.1pF 50V C0G, NP0 Ceramic Capacitor -55°C ~ 125°C Surface Mount, MLCC 0402 (1005 Metric) 0.039" L x 0.020" W (1.00mm x 0.50mm); Product Range: U Series; Voltage Rating: 50; SVHC: No SVHC (17-Dec-2014); Capacitance Tolerance: ± 0.1; Ceramic Capacitor Case: 0402 [1005 Metric]; Capacitance: 2; Dielectric Characteristic: C0G / NP0; Value: 2pF; Supplier 1: Farnell; Supplier Part Number 1: 2332536; Operating Temperature Max: 125; RoHS: YES; Operating Temperature Min: -55; Capacitance Tolerance ±: ± 0.1; Packaging: Cut Tape; MSL: MSL 1 - Unlimited
MN17-MN20 = Inductor_0603: Manufacturer: BOURNS; Manufacturer Part Number 1: CR0805-J/-000ELF; Part Description: RES SMD 0.0 OHM JUMPER 1/8W 0805; Value: 0uH (0R); Supplier 1: Farnell; Supplier Part Number 1: 2008388; RoHS: YES
MN21 MN22 MN24 MN25 MN34 MN38 = Inductor_0603: Manufacturer: COILCRAFT; Manufacturer Part Number 1: 0402HP-8N2XJLU; Part Description: INDUCTOR, RF, 8.2NH, 5%, 5.4GHZ, SMD; Product Range:0402HP Series; Inductance:8.2nH; Inductance Tolerance:± 5%; High Frequency Inductor Case:0402 [1005 Metric]; Self Resonant Frequency Min:5.4GHz; DC Resistance Max:0.065ohm; DC Current Rating:1.5A; Inductor Construction: Wirewound; DC Current Rating: 1.5; Inductor Case Style: 0402 [1005 Metric]<!--FANDB--><div class="features-and-benefits-container"></div>; Self Resonant Frequency Min: 5.4; DC Resistance Max: 0.065; High Frequency Inductor Case: 0402 [1005 Metric]; SVHC: No SVHC (16-Jun-2014); Inductance: 8.2; Supplier 1: Farnell; Supplier Part Number 1: 2285826; Packaging: Cut Tape; Product Range: COILCRAFT - 0402; Inductance Tolerance: ± 5%; RoHS: Y-EX; Value: 8.2nH, 5%
MN23 MN28 MN29 MN32 MN51 MN55 = Cap_0402: Manufacturer: Murata Electronics North America; Manufacturer Part Number: GRM1555C1HR80BA01D; Part Description: 0.80pF ±0.1pF 50V C0G, NP0 Ceramic Capacitor -55°C ~ 125°C Surface Mount, MLCC 0402 (1005 Metric) 0.039" L x 0.020" W (1.00mm x 0.50mm); Temperature Coefficient: C0G, NP0; Capacitance: 0.80pF; Voltage - Rated: 50V; Tolerance: ±0.1pF; Value: 0.8pF; Applications: General Purpose; Operating Temperature: -55°C ~ 125°C; Size / Dimension: 0.039" L x 0.020" W (1.00mm x 0.50mm); Features: -; Supplier 1: Digi-Key; Height - Seated (Max): -; Category: Capacitors; Package / Case: 0402 (1005 Metric); Mounting Type: Surface Mount, MLCC; Lead Spacing: -; Thickness (Max): 0.022" (0.55mm); RoHS: RoHS Compliant; Supplier Part Number 1: 490-6269-1-ND; Packaging: Cut Tape (CT); Ratings: -; Lead Style: -
MN26 MN30 MN43 MN47 = Cap_0402: Manufacturer: TDK Corporation; Manufacturer Part Number 1: C1005C0G1H010B050BA; Part Description: 1pF ±0.1pF 50V C0G, NP0 Ceramic Capacitor -55°C ~ 125°C Surface Mount, MLCC 0402 (1005 Metric) 0.039" L x 0.020" W (1.00mm x 0.50mm); Voltage - Rated: 50V; Temperature Coefficient: C0G, NP0; Tolerance: ±0.1pF; Value: 1pF; Supplier 1: Digi-Key; Supplier Part Number 1: 445-4854-6-ND; Size / Dimension: 0.039" L x 0.020" W (1.00mm x 0.50mm); Lead Spacing: -; Operating Temperature: -55°C ~ 125°C; Thickness (Max): 0.022" (0.55mm); Package / Case: 0402 (1005 Metric); Features: -; Lead Style: -; Applications: General Purpose; Height - Seated (Max): -; Capacitance: 1pF; RoHS: RoHS Compliant; Mounting Type: Surface Mount, MLCC; Packaging: Digi-Reel®; Ratings: -; Category: Capacitors
MN33 MN36 MN37 MN40 = Cap_0402: Manufacturer: Murata Electronics North America; Manufacturer Part Number: GRM1555C1H511JA01D; Part Description: 510pF ±5% 50V C0G, NP0 Ceramic Capacitor -55°C ~ 125°C Surface Mount, MLCC 0402 (1005 Metric) 0.039" L x 0.020" W (1.00mm x 0.50mm); Voltage - Rated: 50V; Temperature Coefficient: C0G, NP0; Tolerance: ±5%; Value: 510pF; Supplier 1: Digi-Key; Supplier Part Number 1: 490-3237-1-ND; Height - Seated (Max): -; Features: -; Size / Dimension: 0.039" L x 0.020" W (1.00mm x 0.50mm); Applications: General Purpose; Lead Spacing: -; Package / Case: 0402 (1005 Metric); Ratings: -; Thickness (Max): 0.022" (0.55mm); Lead Style: -; Operating Temperature: -55°C ~ 125°C; Mounting Type: Surface Mount, MLCC; Capacitance: 510pF; Category: Capacitors; RoHS: RoHS Compliant; Packaging: Cut Tape (CT)
MN35 MN39 = Cap_0402: Manufacturer: Murata Electronics North America; Manufacturer Part Number: GRM1555C1H1R2CA01D; Part Description: 1.2pF ±0.25pF 50V C0G, NP0 Ceramic Capacitor -55°C ~ 125°C Surface Mount, MLCC 0402 (1005 Metric) 0.039" L x 0.020" W (1.00mm x 0.50mm); Temperature Coefficient: C0G, NP0; Voltage - Rated: 50V; Tolerance: ±0.25pF; Value: 1.2pF; Supplier 1: Digi-Key; Supplier Part Number 1: 490-5927-1-ND; Lead Style: -; Category: Capacitors; Features: -; Packaging: Cut Tape (CT); Operating Temperature: -55°C ~ 125°C; Package / Case: 0402 (1005 Metric); Applications: General Purpose; Size / Dimension: 0.039" L x 0.020" W (1.00mm x 0.50mm); Lead Spacing: -; Ratings: -; Mounting Type: Surface Mount, MLCC; RoHS: RoHS Compliant; Height - Seated (Max): -; Thickness (Max): 0.022" (0.55mm); Capacitance: 1.2pF
MN50 MN54 = Inductor_0603: Manufacturer Part Number 1: 0402HP-10NXJLU; Manufacturer: COILCRAFT; Part Description: INDUCTOR, RF, 10NH, 5%, 4.7GHZ, SMD; Product Range:0402HP Series; Inductance:10nH; Inductance Tolerance:± 5%; High Frequency Inductor Case:0402 [1005 Metric]; Self Resonant Frequency Min:4.7GHz; DC Resistance Max:0.11ohm; DC Current Rating:1.3A; Value: 10nH, 5%; Supplier 1: Farnell; Supplier Part Number 1: 2285830; RoHS: Y-EX
T1 T2 T5 T6 T9 T10 = Balun: Manufacturer: Mini-Circuits; Part Description: RF balun, TC1-1-13MA+; Manufacturer Part Number 1: TC1-1-13MA+; Supplier Part Number 1: TC1-1-13MA+; Supplier 1: Minicircuits
T3 T4 T7 T8 = Balun_v2: Manufacturer: Mini-circuits; Part Description: RF balun, TCM1-63AX+; Supplier Part Number 1: TCM1-63AX+; Manufacturer Part Number 1: TCM1-63AX+; Supplier 1: Minicircuits

## Sheet 06_LMS7002M_Power.SchDoc: LMS7002M power supply
size A3 portrait; Organization: Lime Microsystems; Address1: Surrey Tech Centre; Address2: Guildford GU2 7YG; Address3: Surrey; Address4: United Kingdom; Revision: v1.2; SheetNumber: 6; SheetTotal: 14; PageSetup: Record=PageOptions|CenterHorizontal=True|CenterVertical=True|PrintScale=0.70|XCorrection=1.00|YCorrection=1.00|PrintKind=1|BorderSize=5000000|LeftOffset=0|BottomOffset=0|Orientation=1|PaperLength=2970|PaperWidth=2100|Scale=100|PaperSource=7|PrintQuality=600|MediaType=1|DitherType=10|PrintScaleMode=1|PaperKind=A4|PaperIndex=9
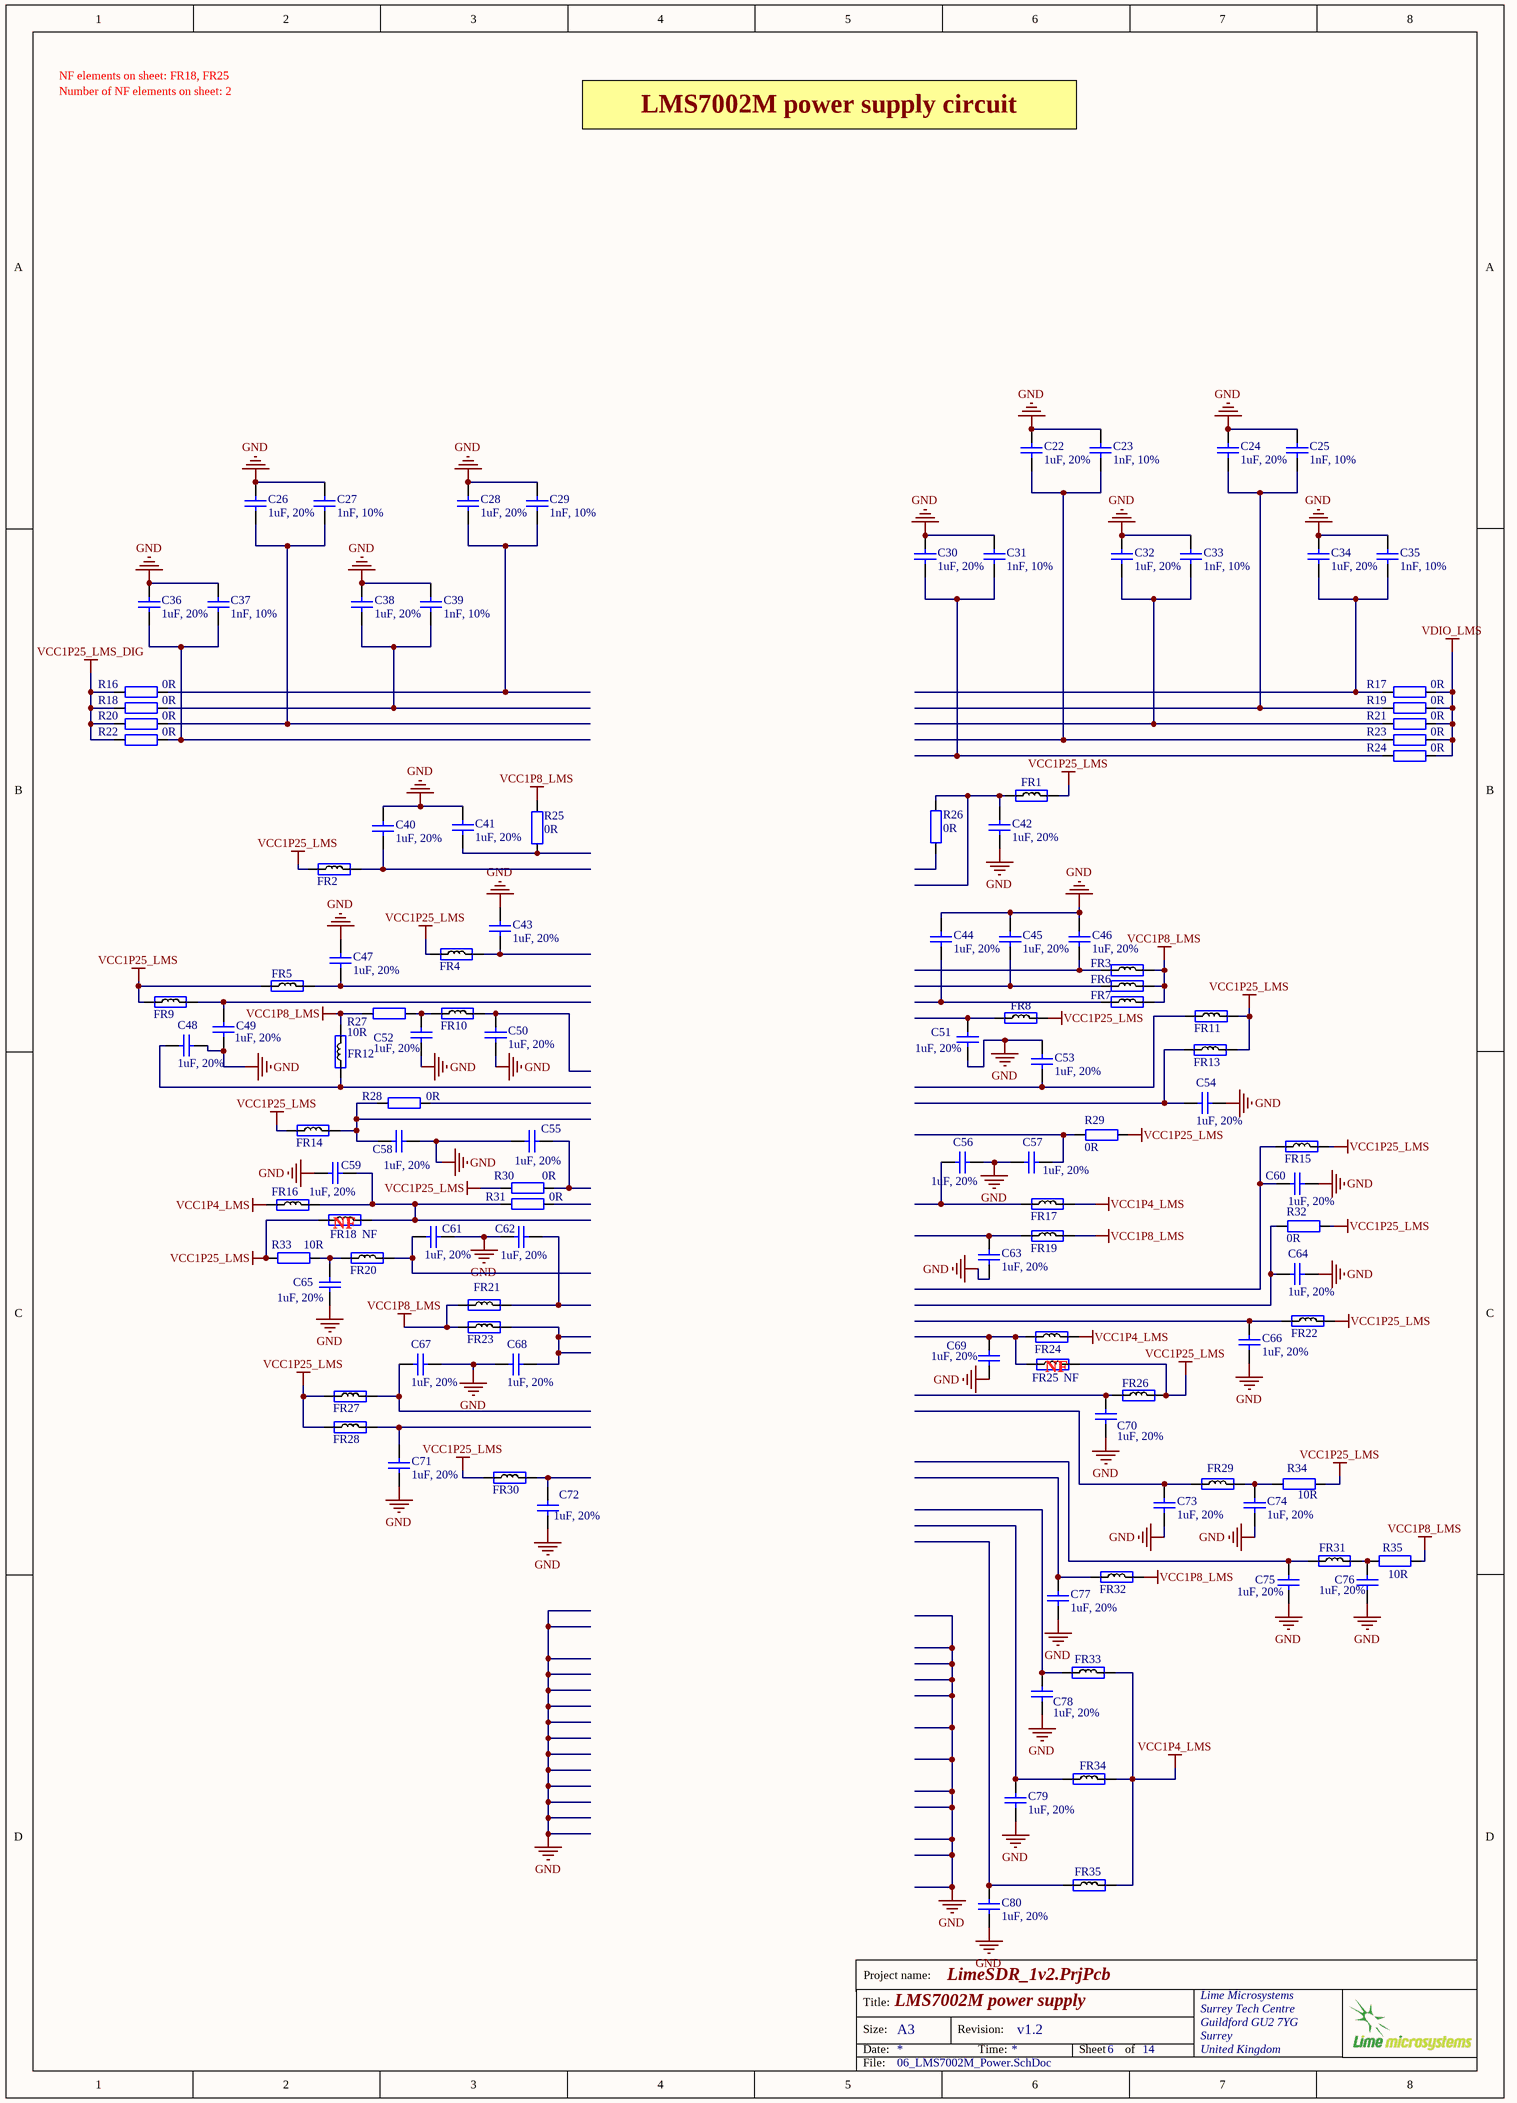
[diagram p2: 06_LMS7002M_Power.SchDoc]

### Parts
C22  1uF, 20%  [CAP0201]
C23  1nF, 10%  [CAP0201]
C24  1uF, 20%  [CAP0201]
C25  1nF, 10%  [CAP0201]
C26  1uF, 20%  [CAP0201]
C27  1nF, 10%  [CAP0201]
C28  1uF, 20%  [CAP0201]
C29  1nF, 10%  [CAP0201]
C30  1uF, 20%  [CAP0201]
C31  1nF, 10%  [CAP0201]
C32  1uF, 20%  [CAP0201]
C33  1nF, 10%  [CAP0201]
C34  1uF, 20%  [CAP0201]
C35  1nF, 10%  [CAP0201]
C36  1uF, 20%  [CAP0201]
C37  1nF, 10%  [CAP0201]
C38  1uF, 20%  [CAP0201]
C39  1nF, 10%  [CAP0201]
C40  1uF, 20%  [CAP0201]
C41  1uF, 20%  [CAP0201]
C42  1uF, 20%  [CAP0201]
C43  1uF, 20%  [CAP0201]
C44  1uF, 20%  [CAP0201]
C45  1uF, 20%  [CAP0201]
C46  1uF, 20%  [CAP0201]
C47  1uF, 20%  [CAP0201]
C48  1uF, 20%  [CAP0201]
C49  1uF, 20%  [CAP0201]
C50  1uF, 20%  [CAP0201]
C51  1uF, 20%  [CAP0201]
C52  1uF, 20%  [CAP0201]
C53  1uF, 20%  [CAP0201]
C54  1uF, 20%  [CAP0201]
C55  1uF, 20%  [CAP0201]
C56  1uF, 20%  [CAP0201]
C57  1uF, 20%  [CAP0201]
C58  1uF, 20%  [CAP0201]
C59  1uF, 20%  [CAP0201]
C60  1uF, 20%  [CAP0201]
C61  1uF, 20%  [CAP0201]
C62  1uF, 20%  [CAP0201]
C63  1uF, 20%  [CAP0201]
C64  1uF, 20%  [CAP0201]
C65  1uF, 20%  [CAP0201]
C66  1uF, 20%  [CAP0201]
C67  1uF, 20%  [CAP0201]
C68  1uF, 20%  [CAP0201]
C69  1uF, 20%  [CAP0201]
C70  1uF, 20%  [CAP0201]
C71  1uF, 20%  [CAP0201]
C72  1uF, 20%  [CAP0201]
C73  1uF, 20%  [CAP0201]
C74  1uF, 20%  [CAP0201]
C75  1uF, 20%  [CAP0201]
C76  1uF, 20%  [CAP0201]
C77  1uF, 20%  [CAP0201]
C78  1uF, 20%  [CAP0201]
C79  1uF, 20%  [CAP0201]
C80  1uF, 20%  [CAP0201]
FR1  Ferrite  [RES0201]  (value not drawn)
FR2  Ferrite  [RES0201]  (value not drawn)
FR3  Ferrite  [RES0201]  (value not drawn)
FR4  Ferrite  [RES0201]  (value not drawn)
FR5  Ferrite  [RES0201]  (value not drawn)
FR6  Ferrite  [RES0201]  (value not drawn)
FR7  Ferrite  [RES0201]  (value not drawn)
FR8  Ferrite  [RES0201]  (value not drawn)
FR9  Ferrite  [RES0201]  (value not drawn)
FR10  Ferrite  [RES0201]  (value not drawn)
FR11  Ferrite  [RES0201]  (value not drawn)
FR12  Ferrite  [RES0201]  (value not drawn)
FR13  Ferrite  [RES0201]  (value not drawn)
FR14  Ferrite  [RES0201]  (value not drawn)
FR15  Ferrite  [RES0201]  (value not drawn)
FR16  Ferrite  [RES0201]  (value not drawn)
FR17  Ferrite  [RES0201]  (value not drawn)
FR18  Assembly Info: NF  [RES0201]  (hidden comment: Ferrite)
FR19  Ferrite  [RES0201]  (value not drawn)
FR20  Ferrite  [RES0201]  (value not drawn)
FR21  Ferrite  [RES0201]  (value not drawn)
FR22  Ferrite  [RES0201]  (value not drawn)
FR23  Ferrite  [RES0201]  (value not drawn)
FR24  Ferrite  [RES0201]  (value not drawn)
FR25  Assembly Info: NF  [RES0201]  (hidden comment: Ferrite)
FR26  Ferrite  [RES0201]  (value not drawn)
FR27  Ferrite  [RES0201]  (value not drawn)
FR28  Ferrite  [RES0201]  (value not drawn)
FR29  Ferrite  [RES0201]  (value not drawn)
FR30  Ferrite  [RES0201]  (value not drawn)
FR31  Ferrite  [RES0201]  (value not drawn)
FR32  Ferrite  [RES0201]  (value not drawn)
FR33  Ferrite  [RES0201]  (value not drawn)
FR34  Ferrite  [RES0201]  (value not drawn)
FR35  Ferrite  [RES0201]  (value not drawn)
R16  0R  [RES0402]
R17  0R  [RES0402]
R18  0R  [RES0402]
R19  0R  [RES0402]
R20  0R  [RES0402]
R21  0R  [RES0402]
R22  0R  [RES0402]
R23  0R  [RES0402]
R24  0R  [RES0402]
R25  0R  [RES0201]
R26  0R  [RES0201]
R27  10R  [RES0201]
R28  0R  [RES0201]
R29  0R  [RES0201]
R30  0R  [RES0201]
R31  0R  [RES0201]
R32  0R  [RES0201]
R33  10R  [RES0201]
R34  10R  [RES0201]
R35  10R  [RES0201]

### Nets
GND: C22.2 C23.2 C24.2 C25.2 C26.2 C27.2 C28.2 C29.2 C30.2 C31.2 C32.2 C33.2 C34.2 C35.2 C36.2 C37.2 C38.2 C39.2 C40.2 C41.2 C42.2 C43.2 C44.2 C45.2 C46.2 C47.2 C48.2 C49.2 C50.2 C51.2 C52.2 C53.2 C54.2 C55.2 C56.2 C57.2 C58.1 C59.2 C60.2 C61.2 C62.2 C63.2 C64.2 C65.2 C66.2 C67.2 C68.2 C69.2 C70.2 C71.2 C72.2 C73.2 C74.2 C75.2 C76.2 C77.2 C78.2 C79.2 C80.2
VCC1P4_LMS: FR16.1 FR17.2 FR24.2 FR33.2 FR34.2 FR35.2
VCC1P8_LMS: FR3.2 FR6.2 FR7.2 FR12.2 FR19.2 FR21.1 FR23.1 FR32.2 R25.2 R27.2 R35.1
VCC1P25_LMS: FR1.2 FR2.1 FR4.1 FR5.1 FR8.2 FR9.1 FR11.2 FR13.2 FR14.1 FR15.2 FR18.1 FR22.2 FR25.2 FR26.2 FR27.1 FR28.1 FR30.1 R29.1 R30.2 R32.1 R33.2 R34.1
VCC1P25_LMS_DIG: R16.2 R18.2 R20.2 R22.2
VDIO_LMS: R17.1 R19.1 R21.1 R23.1 R24.1
NetC22_1: C22.1 C23.1 R23.2
NetC24_1: C24.1 C25.1 R19.2
NetC26_1: C26.1 C27.1 R20.1
NetC28_1: C28.1 C29.1 R16.1
NetC30_1: C30.1 C31.1 R24.2
NetC32_1: C32.1 C33.1 R21.2
NetC34_1: C34.1 C35.1 R17.2
NetC36_1: C36.1 C37.1 R22.1
NetC38_1: C38.1 C39.1 R18.1
NetC40_1: C40.1 FR2.2
NetC41_1: C41.1 R25.1
NetC42_1: C42.1 FR1.1 R26.1
NetC43_1: C43.1 FR4.2
NetC44_1: C44.1 FR7.1
NetC45_1: C45.1 FR6.1
NetC46_1: C46.1 FR3.1
NetC47_1: C47.1 FR5.2
NetC48_1: C48.1 FR12.1
NetC49_1: C49.1 FR9.2
NetC50_1: C50.1 FR10.2
NetC51_1: C51.1 FR8.1
NetC52_1: C52.1 FR10.1 R27.1
NetC53_1: C53.1 FR11.1
NetC54_1: C54.1 FR13.1
NetC55_1: C55.1 R30.1
NetC56_1: C56.1 FR17.1
NetC57_1: C57.1 R29.2
NetC58_2: C58.2 FR14.2 R28.2
NetC59_1: C59.1 FR16.2 FR18.2 R31.2
NetC60_1: C60.1 FR15.1
NetC61_1: C61.1 FR20.2
NetC62_1: C62.1 FR21.2
NetC63_1: C63.1 FR19.1
NetC64_1: C64.1 R32.2
NetC65_1: C65.1 FR20.1 R33.1
NetC66_1: C66.1 FR22.1
NetC67_1: C67.1 FR27.2
NetC68_1: C68.1 FR23.2
NetC69_1: C69.1 FR24.1 FR25.1
NetC70_1: C70.1 FR26.1
NetC71_1: C71.1 FR28.2
NetC72_1: C72.1 FR30.2
NetC73_1: C73.1 FR29.1
NetC74_1: C74.1 FR29.2 R34.2
NetC75_1: C75.1 FR31.1
NetC76_1: C76.1 FR31.2 R35.2
NetC77_1: C77.1 FR32.1
NetC78_1: C78.1 FR33.1
NetC79_1: C79.1 FR34.1
NetC80_1: C80.1 FR35.1

Not connected (* = marked no-connect by the designer): R26 2; R28 1; R31 1

### Notes on the sheet
- Number of NF elements on sheet: 2
- NF elements on sheet: FR18, FR25
- LMS7002M power supply circuit
- (near FR18) NF
- (near FR25) NF
- Project name:
- Title:
- Size:
- Date:
- A3
- Revision:
- Time:
- Sheet
- of
- File:

### Library data of the parts
C22 C24 C26 C28 C30 C32 C34 C36 C38 C40-C80 = Cap_0402: Manufacturer: TDK Corporation; Manufacturer Part Number 1: C0603X5R0J105M030BC; Part Description: 1µF ±20% 6.3V X5R Ceramic Capacitor -55°C ~ 85°C Surface Mount, MLCC 0201 (0603 Metric) 0.024" L x 0.012" W (0.60mm x 0.30mm); Capacitance: 1.0µF; Voltage - Rated: 6.3V; Temperature Coefficient: X5R; Value: 1uF, 20%; Supplier 1: Digi-Key; Supplier Part Number 1: 445-8008-1-ND; Applications: General Purpose; Features: -; Lead Style: -; Ratings: -; Thickness (Max): -; Lead Spacing: -; Height - Seated (Max): -; Size / Dimension: 0.024" L x 0.012" W (0.60mm x 0.30mm); Mounting Type: Surface Mount, MLCC; Operating Temperature: -55°C ~ 85°C; Package / Case: 0201 (0603 Metric); Tolerance: ±20%; Packaging: Cut Tape (CT); Category: Capacitors; RoHS: RoHS Compliant
C23 C25 C27 C29 C31 C33 C35 C37 C39 = Cap_0402: Manufacturer Part Number 1: C0603X7R1E102K030BA; Manufacturer: TDK Corporation; Part Description: 1000pF ±10% 25V X7R Ceramic Capacitor -55°C ~ 125°C Surface Mount, MLCC 0201 (0603 Metric) 0.024" L x 0.012" W (0.60mm x 0.30mm); Voltage - Rated: 25V; Temperature Coefficient: X7R; Capacitance: 1000pF; Value: 1nF, 10%; Supplier 1: Digi-Key; Supplier Part Number 1: 445-7275-1-ND; Features: -; Package / Case: 0201 (0603 Metric); Lead Spacing: -; Mounting Type: Surface Mount, MLCC; Lead Style: -; Height - Seated (Max): -; Operating Temperature: -55°C ~ 125°C; Tolerance: ±10%; Size / Dimension: 0.024" L x 0.012" W (0.60mm x 0.30mm); Applications: General Purpose; Ratings: -; Thickness (Max): 0.013" (0.33mm); RoHS: RoHS Compliant; Packaging: Cut Tape (CT); Category: Capacitors
FR1-FR35 = Ferrite: Manufacturer Part Number 1: BK0603TS601-T; Manufacturer: Taiyo Yuden; Part Description: FERRITE BEAD 600 OHM 0201 1LN; DC Resistance (DCR): 750 mOhm Max; Filter Type: Differential Mode - Single; Impedance @ Frequency: 600 Ohm @ 100MHz; Current Rating: 270mA; Value: 600R@100MHz; Supplier 1: Digi-Key; Supplier Part Number 1: 587-3277-1-ND; Size / Dimension: 0.024" L x 0.012" W (0.60mm x 0.30mm); Package / Case: 0201 (0603 Metric); Height (Max): 0.013" (0.33mm); Mounting Type: Surface Mount; Packaging: Cut Tape (CT); RoHS: RoHS Compliant; Category: Filters
R16-R24 = Res_0402: Manufacturer Part Number 1: RC0402JR-070RL; Manufacturer: Yageo; Part Description: RES SMD 0.0OHM JUMPER 1/16W 0402; Resistance (Ohms): 0.0; Tolerance: Jumper; Power (Watts): 0.063W, 1/16W; Value: 0R; Supplier 1: Digi-Key; Supplier Part Number 1: 311-0.0JRTR-ND; Category: Resistors; Temperature Coefficient: -; Features: Moisture Resistant; Supplier Device Package: 0402; Height: 0.016" (0.40mm); Package / Case: 0402 (1005 Metric); Operating Temperature: -55°C ~ 155°C; Size / Dimension: 0.039" L x 0.020" W (1.00mm x 0.50mm); Composition: Thick Film; Packaging: Tape & Reel (TR); Number of Terminations: 2; RoHS: RoHS Compliant
R25 R26 R28-R32 = Res_0402: Manufacturer Part Number 1: MCR006YRTJ000; Manufacturer: Rohm Semiconductor; Part Description: RES SMD 0.0OHM JUMPER 1/20W 0201; Resistance (Ohms): 0.0; Power (Watts): 0.05W, 1/20W; Tolerance: Jumper; Value: 0R; Supplier 1: Digi-Key; Supplier Part Number 1: RHM0.0CCCT-ND; Number of Terminations: 2; Operating Temperature: -55°C ~ 125°C; Package / Case: 0201 (0603 Metric); Height: 0.010" (0.26mm); Supplier Device Package: 0201 (0603 Metric); Size / Dimension: 0.024" L x 0.012" W (0.60mm x 0.30mm); Temperature Coefficient: -; Category: Resistors; Features: -; RoHS: RoHS Compliant; Composition: Thick Film; Packaging: Cut Tape (CT)
R27 R33-R35 = Res_0402: Manufacturer: Panasonic Electronic Components; Manufacturer Part Number: ERJ-1GEF10R0C; Part Description: RES SMD 10 OHM 1% 1/20W 0201; Power (Watts): 0.05W, 1/20W; Resistance (Ohms): 10; Tolerance: ±1%; Temperature Coefficient: ±200ppm/°C; Value: 10R; Supplier 1: Digi-Key; Supplier Part Number 1: P10.0ABCT-ND; Package / Case: 0201 (0603 Metric); Height: 0.010" (0.26mm); Supplier Device Package: 0201; Packaging: Cut Tape (CT); Composition: Thick Film; Category: Resistors; Number of Terminations: 2; Size / Dimension: 0.024" L x 0.012" W (0.60mm x 0.30mm); Operating Temperature: -55°C ~ 125°C; Features: -; RoHS: RoHS Compliant

## Sheet 07_FPGA_banks_1_2_3_4.SchDoc: FPGA banks 1, 2, 3, 4
size A3; Organization: Lime Microsystems; Address1: Surrey Tech Centre; Address2: Guildford GU2 7YG; Address3: Surrey; Address4: United Kingdom; Revision: v1.2; SheetNumber: 7; SheetTotal: 14
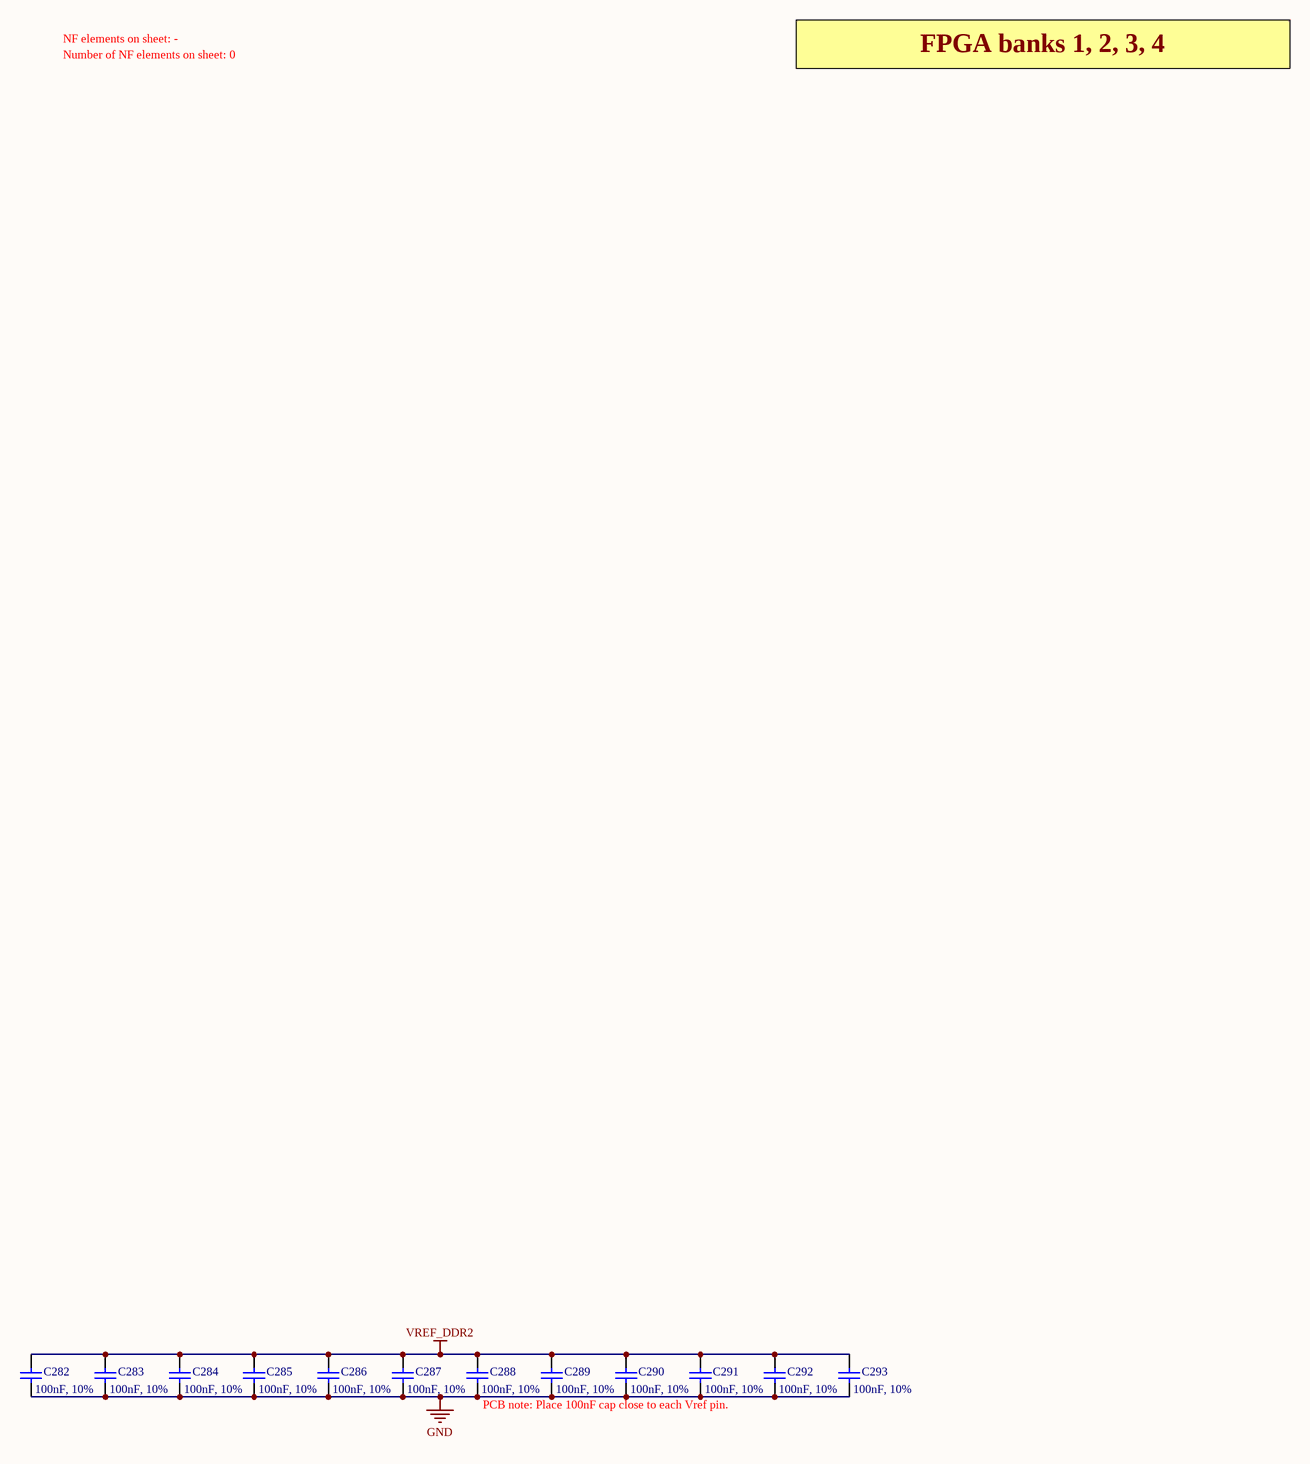
[diagram p3: 07_FPGA_banks_1_2_3_4.SchDoc]

### Parts
C282  100nF, 10%  [CAP0402]
C283  100nF, 10%  [CAP0402]
C284  100nF, 10%  [CAP0402]
C285  100nF, 10%  [CAP0402]
C286  100nF, 10%  [CAP0402]
C287  100nF, 10%  [CAP0402]
C288  100nF, 10%  [CAP0402]
C289  100nF, 10%  [CAP0402]
C290  100nF, 10%  [CAP0402]
C291  100nF, 10%  [CAP0402]
C292  100nF, 10%  [CAP0402]
C293  100nF, 10%  [CAP0402]

### Nets
GND: C282.2 C283.2 C284.2 C285.2 C286.2 C287.2 C288.2 C289.2 C290.2 C291.2 C292.2 C293.2
VREF_DDR2: C282.1 C283.1 C284.1 C285.1 C286.1 C287.1 C288.1 C289.1 C290.1 C291.1 C292.1 C293.1

### Notes on the sheet
- NF elements on sheet: -
- Number of NF elements on sheet: 0
- FPGA banks 1, 2, 3, 4
- PCB note: Place 100nF cap close to each Vref pin.
- Project name:
- Title:
- Size:
- Date:
- A3
- Revision:
- Time:
- Sheet
- of
- File:

### Library data of the parts
C282-C293 = Cap_0603: Manufacturer Part Number 1: GRM155R71C104KA88D; Part Description: 0.10µF ±10% 16V X7R Ceramic Capacitor -55°C ~ 125°C Surface Mount, MLCC 0402 (1005 Metric) 0.039" L x 0.020" W (1.00mm x 0.50mm); Brand: Murata Electronics; Type: General Purpose MLCC; Capacitance: 0.1 uF; Temperature Coefficient / Code: +/- 15 %; Voltage Rating DC: 16 V; Supplier 1: Mouser; Supplier Part Number 1: 81-GRM155R71C104KA88; Tolerance: 10 %; Case Code - in: 0402; Manufacturer: Murata Electronics; Category: Multilayer Ceramic Capacitors MLCC - SMD/SMT; Value: 100nF, 10%; Manufacturer Part Number: GRM155R71C104KA88D

## Sheet 08_FPGA_banks_5_6_7_8.SchDoc: FPGA banks 5, 6, 7, 8
size A3; Organization: Lime Microsystems; Address1: Surrey Tech Centre; Address2: Guildford GU2 7YG; Address3: Surrey; Address4: United Kingdom; Revision: v1.2; SheetNumber: 8; SheetTotal: 14
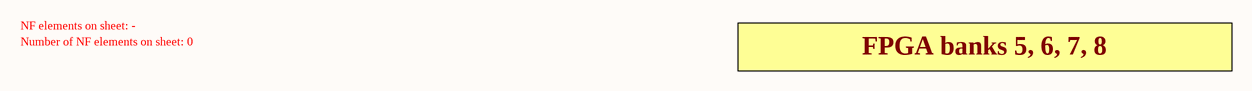
[diagram p4: 08_FPGA_banks_5_6_7_8.SchDoc]

### Notes on the sheet
- NF elements on sheet: -
- Number of NF elements on sheet: 0
- FPGA banks 5, 6, 7, 8
- Project name:
- Title:
- Size:
- Date:
- A3
- Revision:
- Time:
- Sheet
- of
- File:

## Sheet 10_DDR2.SchDoc: RAM DDR2
size A3; Organization: Lime Microsystems; Address1: Surrey Tech Centre; Address2: Guildford GU2 7YG; Address3: Surray; Address4: United Kingdom; Revision: v1.2; SheetNumber: 10; SheetTotal: 14
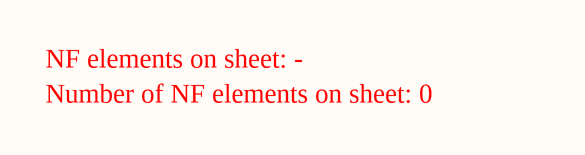
[diagram p5: 10_DDR2.SchDoc]

### Notes on the sheet
- Number of NF elements on sheet: 0
- NF elements on sheet: -
- Project name:
- Title:
- Size:
- Date:
- A3
- Revision:
- Time:
- Sheet
- of
- File:

## Sheet 12_USB3_0_power.SchDoc: USB3.0 power
size A4; Organization: Lime Microsystems; Address1: Surrey Tech Centre; Address2: Guildford GU2 7YG; Address3: Surray; Address4: United Kingdom; Revision: v1.2; SheetNumber: 12; SheetTotal: 14
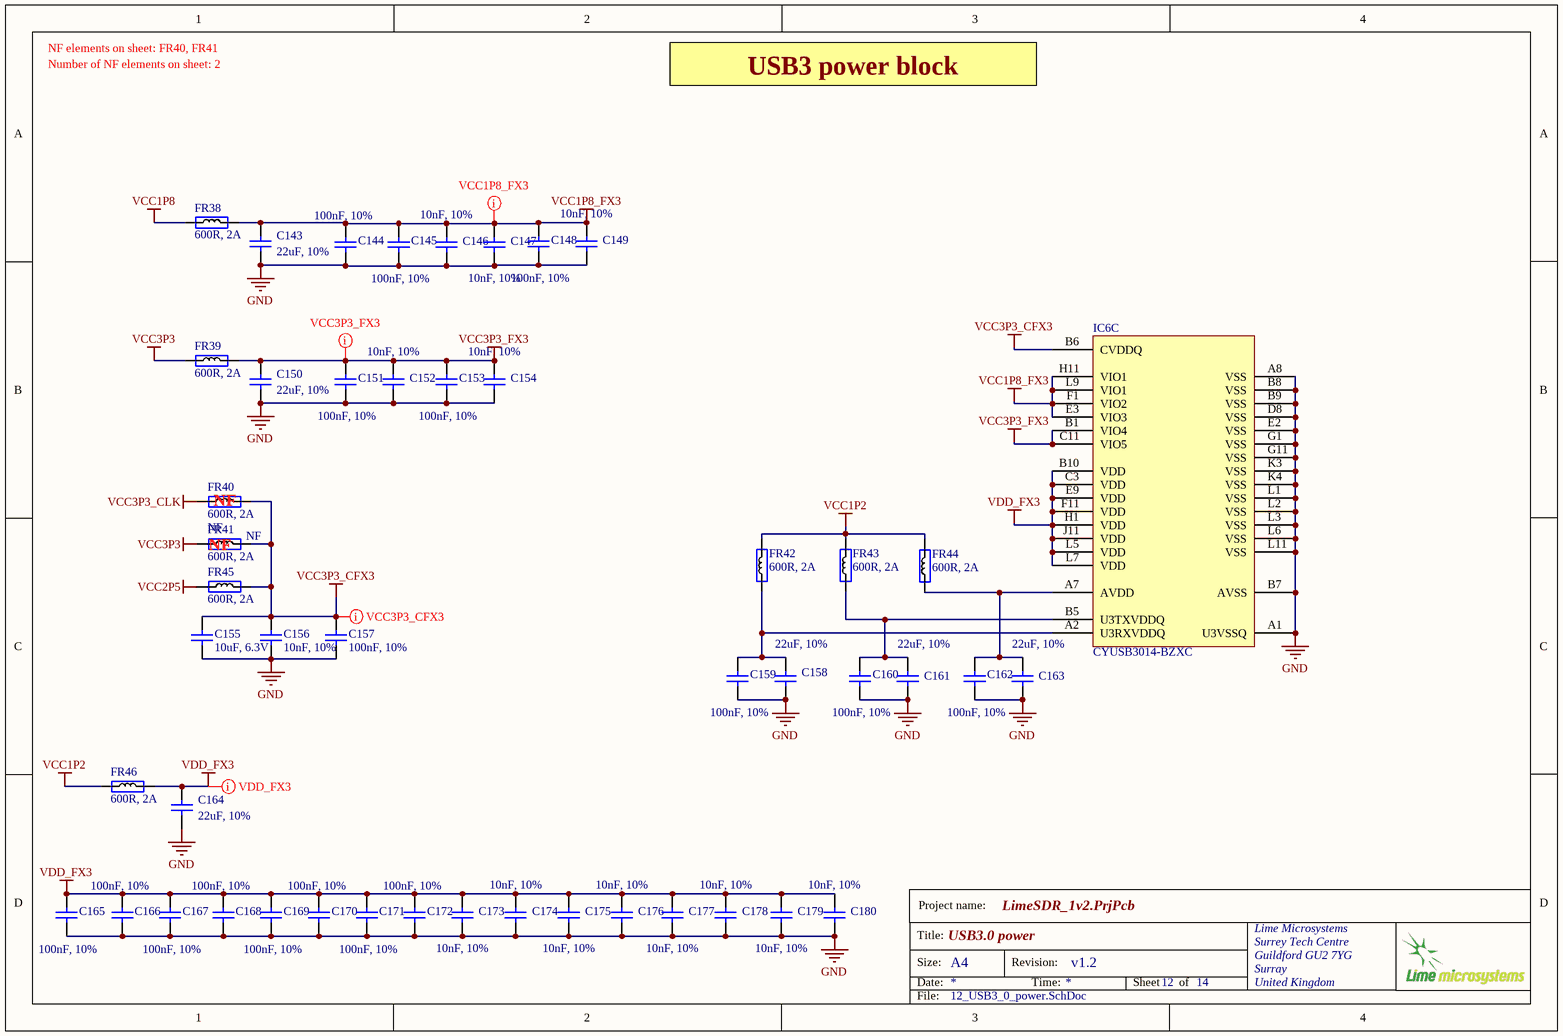
[diagram p6: 12_USB3_0_power.SchDoc]

### Parts
C143  22uF, 10%  [CAP0603]
C144  100nF, 10%  [CAP0402]
C145  100nF, 10%  [CAP0402]
C146  10nF, 10%  [CAP0402]
C147  10nF, 10%  [CAP0402]
C148  100nF, 10%  [CAP0402]
C149  10nF, 10%  [CAP0402]
C150  22uF, 10%  [CAP0603]
C151  100nF, 10%  [CAP0402]
C152  10nF, 10%  [CAP0402]
C153  100nF, 10%  [CAP0402]
C154  10nF, 10%  [CAP0402]
C155  10uF, 6.3V  [CAP0603]
C156  10nF, 10%  [CAP0402]
C157  100nF, 10%  [CAP0402]
C158  22uF, 10%  [CAP0603]
C159  100nF, 10%  [CAP0402]
C160  100nF, 10%  [CAP0402]
C161  22uF, 10%  [CAP0603]
C162  100nF, 10%  [CAP0402]
C163  22uF, 10%  [CAP0603]
C164  22uF, 10%  [CAP0603]
C165  100nF, 10%  [CAP0402]
C166  100nF, 10%  [CAP0402]
C167  100nF, 10%  [CAP0402]
C168  100nF, 10%  [CAP0402]
C169  100nF, 10%  [CAP0402]
C170  100nF, 10%  [CAP0402]
C171  100nF, 10%  [CAP0402]
C172  100nF, 10%  [CAP0402]
C173  10nF, 10%  [CAP0402]
C174  10nF, 10%  [CAP0402]
C175  10nF, 10%  [CAP0402]
C176  10nF, 10%  [CAP0402]
C177  10nF, 10%  [CAP0402]
C178  10nF, 10%  [CAP0402]
C179  10nF, 10%  [CAP0402]
C180  10nF, 10%  [CAP0402]
FR38  600R, 2A  [RES0805]
FR39  600R, 2A  [RES0805]
FR40  600R, 2A  Assembly Info: NF  [RES0805]
FR41  600R, 2A  Assembly Info: NF  [RES0805]
FR42  600R, 2A  [RES0805]
FR43  600R, 2A  [RES0805]
FR44  600R, 2A  [RES0805]
FR45  600R, 2A  [RES0805]
FR46  600R, 2A  [RES0805]
IC6  CYUSB3014-BZXC  [CYP-BZX121]  (part C of 3)

### Nets
GND: C143.1 C144.2 C145.2 C146.1 C147.1 C148.2 C149.1 C150.1 C151.2 C152.1 C153.2 C154.1 C155.1 C156.1 C157.2 C158.1 C159.2 C160.2 C161.1 C162.2 C163.1 C164.1 C165.2 C166.2 C167.2 C168.2 C169.2 C170.2 C171.2 C172.2 C173.1 C174.1 C175.1 C176.1 C177.1 C178.1 C179.1 C180.1 IC6.A1(U3VSSQ) IC6.A8(VSS) IC6.B7(AVSS) IC6.B8(VSS) IC6.B9(VSS) IC6.D8(VSS) IC6.E2(VSS) IC6.G1(VSS) IC6.G11(VSS) IC6.K3(VSS) IC6.K4(VSS) IC6.L1(VSS) IC6.L2(VSS) IC6.L3(VSS) IC6.L6(VSS) IC6.L11(VSS)
VCC1P2: FR42.2 FR43.2 FR44.2 FR46.1
VCC1P8: FR38.1
VCC1P8_FX3: C143.2 C144.1 C145.1 C146.2 C147.2 C148.1 C149.2 FR38.2 IC6.E3(VIO3) IC6.F1(VIO2) IC6.H11(VIO1) IC6.L9(VIO1)
VCC2P5: FR45.2
VCC3P3: FR39.1 FR41.2
VCC3P3_CFX3: C155.2 C156.2 C157.1 FR40.1 FR41.1 FR45.1 IC6.B6(CVDDQ)
VCC3P3_CLK: FR40.2
VCC3P3_FX3: C150.2 C151.1 C152.2 C153.1 C154.2 FR39.2 IC6.B1(VIO4) IC6.C11(VIO5)
VDD_FX3: C164.2 C165.1 C166.1 C167.1 C168.1 C169.1 C170.1 C171.1 C172.1 C173.2 C174.2 C175.2 C176.2 C177.2 C178.2 C179.2 C180.2 FR46.2 IC6.B10(VDD) IC6.C3(VDD) IC6.E9(VDD) IC6.F11(VDD) IC6.H1(VDD) IC6.J11(VDD) IC6.L5(VDD) IC6.L7(VDD)
NetC158_2: C158.2 C159.1 FR42.1 IC6.A2(U3RXVDDQ)
NetC160_1: C160.1 C161.2 FR43.1 IC6.B5(U3TXVDDQ)
NetC162_1: C162.1 C163.2 FR44.1 IC6.A7(AVDD)

### Layout directives
net class VCC1P8_FX3: VCC1P8_FX3
net class VCC3P3_FX3: VCC3P3_FX3
net class VCC3P3_CFX3: VCC3P3_CFX3
net class VDD_FX3: VDD_FX3

### Notes on the sheet
- Number of NF elements on sheet: 2
- NF elements on sheet: FR40, FR41
- USB3 power block
- (near FR40) NF
- (near FR41) NF
- Project name:
- Title:
- Size:
- Date:
- A4
- Revision:
- Time:
- Sheet
- of
- File:

### Library data of the parts
C143 C150 C158 C161 C163 C164 = Cap_0603: Manufacturer Part Number 1: C1608X5R1A226M080AC; Part Description: 22µF ±20% 10V X5R Ceramic Capacitor -55°C ~ 85°C Surface Mount, MLCC 0603 (1608 Metric) 0.063" L x 0.031" W (1.60mm x 0.80mm); Voltage Rating DC: 10 V; Brand: TDK; Temperature Coefficient / Code: +/- 15 %; Tolerance: 20 %; Type: Multilayer Ceramic Chip Capacitor; Supplier 1: Mouser; Supplier Part Number 1: 810-C1608X5R1A226M; Package / Case: 0603 (1608 metric); Category: Multilayer Ceramic Capacitors MLCC - SMD/SMT; Capacitance: 22 uF; Operating Temperature Range: - 55 C to + 85 C; Case Code - in: 0603; Case Code - mm: 1608; Value: 22uF, 10%
C144 C145 C148 C151 C153 C157 C159 C160 C162 C165-C172 = Cap_0603: as C282 on sheet 07_FPGA_banks_1_2_3_4; Supplier 1: Mouser; Supplier Part Number 1: 81-GRM155R71C104KA88; Tolerance: 10 %; Case Code - in: 0402; Manufacturer: Murata Electronics; Category: Multilayer Ceramic Capacitors MLCC - SMD/SMT; Value: 100nF, 10%; Manufacturer Part Number: GRM155R71C104KA88D
C146 C147 C149 C152 C154 C156 C173-C180 = Cap_0603: Part Description: 10000pF ±10% 50V X7R Ceramic Capacitor -55°C ~ 125°C Surface Mount, MLCC 0402 (1005 Metric) 0.039" L x 0.020" W (1.00mm x 0.50mm); Manufacturer: Yageo; Capacitance: 10000pF; Voltage - Rated: 50V; Supplier 1: Digi-Key; Supplier Part Number 1: 311-1349-2-ND; Category: Capacitors; Package / Case: 0402 (1005 Metric); Tolerance: ±10%; Value: 10nF, 10%
C155 = Cap_0603: Manufacturer Part Number 1: CC0603MRX5R5BB106; Part Description: 10µF ±20% 6.3V X5R Ceramic Capacitor -55°C ~ 85°C Surface Mount, MLCC 0603 (1608 Metric) 0.063" L x 0.031" W (1.60mm x 0.80mm); Manufacturer: Yageo; Capacitance: 10µF; Tolerance: ±20%; Supplier 1: Digi-Key; Supplier Part Number 1: 311-1448-2-ND; Package / Case: 0603 (1608 Metric); Category: Capacitors; Voltage - Rated: 6.3V; Value: 10uF, 6.3V
FR38-FR46 = Ferrite: Manufacturer Part Number 1: MPZ2012S601A; Manufacturer: TDK; Part Description: FERRITE BEAD 600 OHM 0805 1LN; Impedance Tolerance: ± 25%; Impedance @ 100MHz: 600; Ferrite Mounting: SMD; DC Resistance Max: 0.1; DC Current Rating: 2; Ferrite Case Style: 0805 [2012 Metric]; Supplier 1: Farnell; Supplier Part Number 1: 1669753RL; Supplier: Farnell; Core Material: Ferrite; Value: 600R, 2A
IC6 = CYUSB3014-BZXC: EZ-USB(R) FX3: SuperSpeed USB Controller, 512 KB, 60 I/Os, 0 to 70 degC, 121-Pin FBGA (BZX121); Manufacturer: Cypress Semiconductor Corp; CPU Core: ARM926 EJ-S; Max. Operating Voltage (V): 1.25; Memory Architecture: SRAM; Memory Size (KB): 512; Min. Operating Voltage (V): 1.15; No. of I/Os: 60; DatasheetVersion: Rev. *O; PackageVersion: Rev. *D; PackageReference: BZX121; PackageDescription: 121-Ball FBGA, Body 10 x 10 mm, Pitch 0.8 mm; Supplier 1: Digi-Key; Supplier Part Number 1: 428-3182-ND; Supplier 2: Farnell; Supplier Part Number 2: 2355789; Supplier 3: Newark; Supplier Part Number 3: 54W7901; Supplier 4: Mouser; Supplier Part Number 4: 727-CYUSB3014-BZXC; Max. Operating Temp. (degreesC): 70; Min. Operating Temp. (degreesC): 0; RoHS: Pb-Free; Mounting Technology: Surface Mount; Code_JEDEC: PUB 95; PartNumber: CYUSB3014-BZXC; ComponentLink1Description: Manufacturer URL; ComponentLink1URL: http://www.cypress.com/; ComponentLink2Description: Datasheet; ComponentLink2URL: http://www.cypress.com/?docID=49087; ComponentLink3Description: Package Specification; ComponentLink3URL: http://www.cypress.com/?docID=45795; Part Description: EZ-USB(R) FX3: SuperSpeed USB Controller, 512 KB, 60 I/Os, 0 to 70 degC, 121-Pin FBGA (BZX121)